# EAGLE board PCB_eLock_G592_J1 (EAGLE 6.2), part 1 of 2
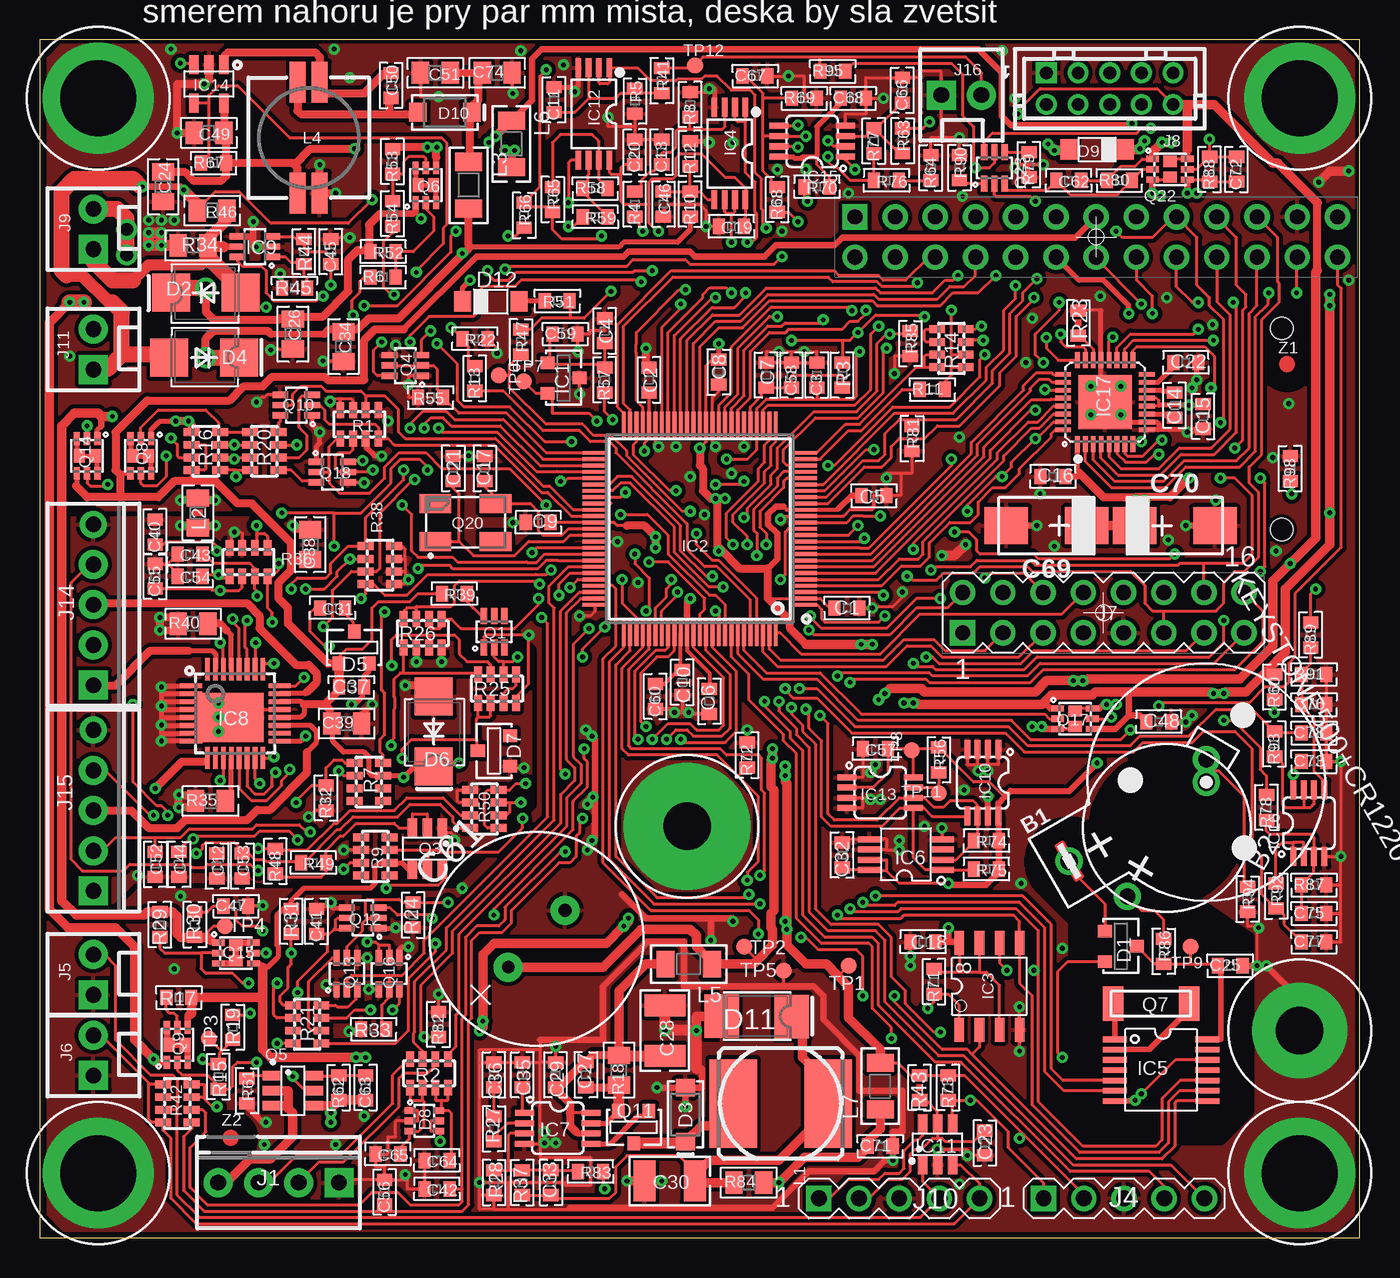
[diagram p3: board, top side]
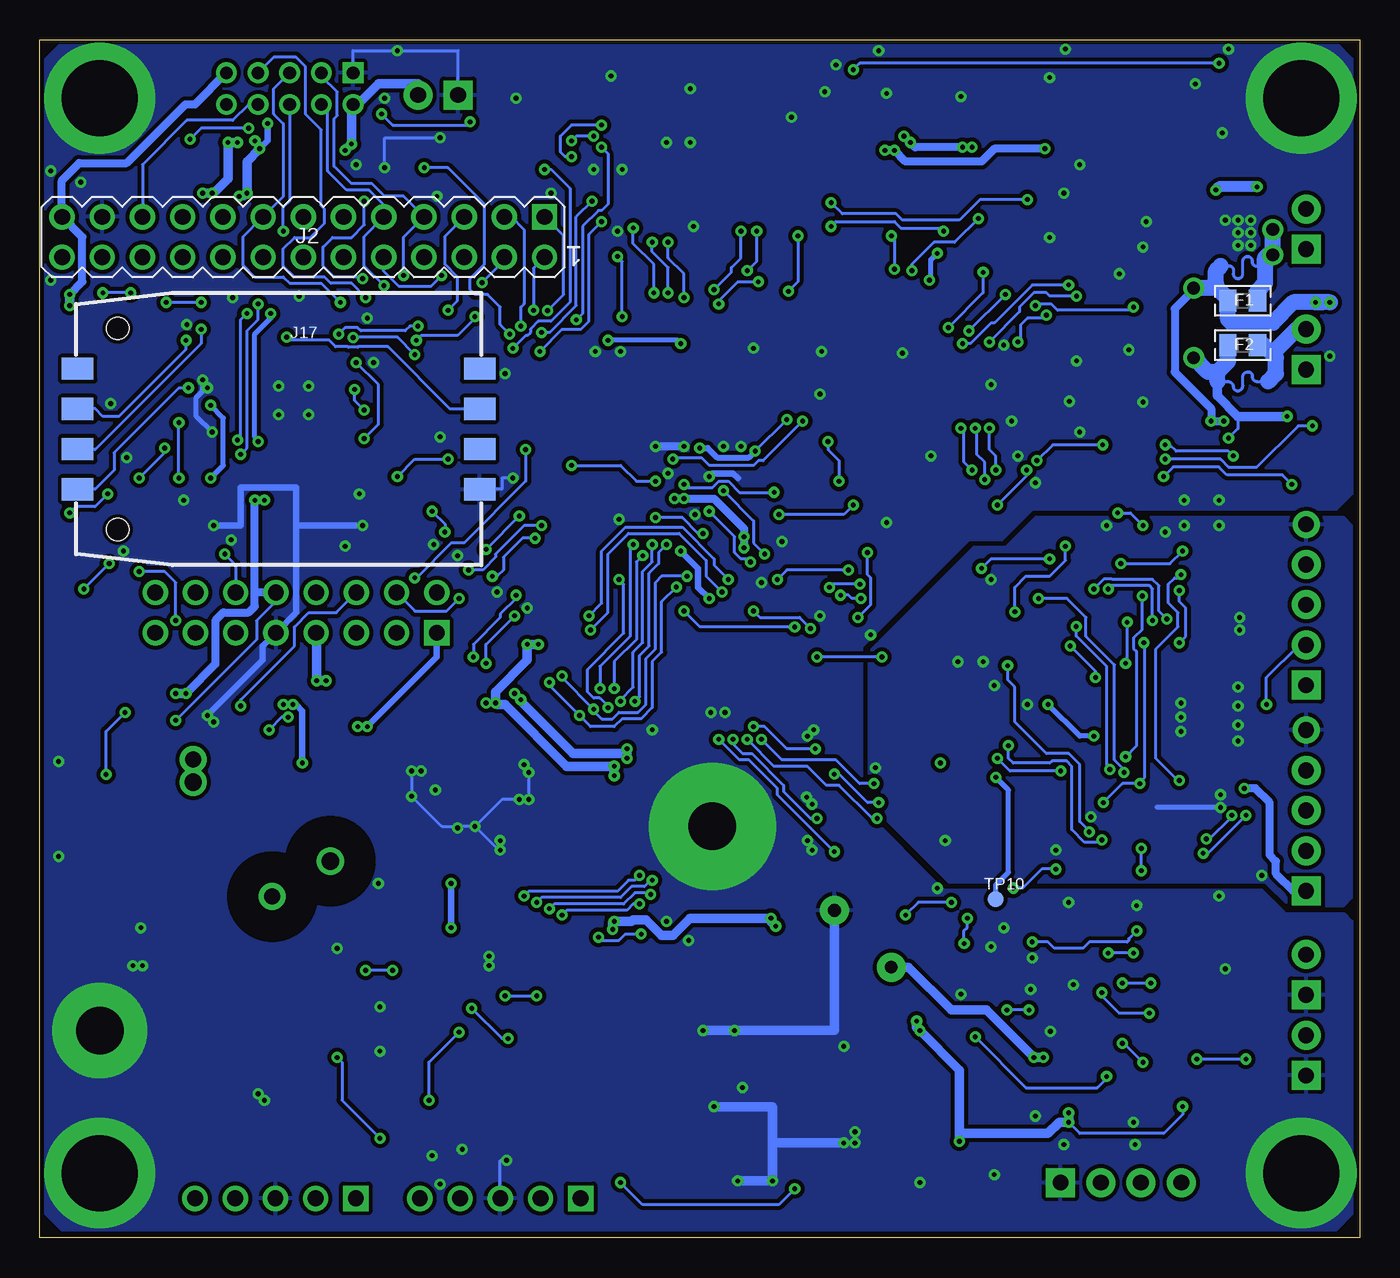
[diagram p4: board, bottom side, seen from below]

Size 83.4 x 75.7 mm. Coordinates in mm from the lower left corner, seen from the top.
Copper layers (1+16): Top 0.035mm / dielectric 1.5mm / Bottom 0.035mm
Design rules: minimum track width 0.2mm, minimum drill 0.3mm, track to track 0.153mm, track to pad 0.15mm, pad to pad 0.162mm, via to via 0.15mm, smd to smd 0.15mm, copper to edge 5mil, drill to drill 8mil, minimum pad ring 0.2mm, minimum via ring 0.2mm, stop-mask expansion 4mil, vias tented up to drill 0.3mm, thermal gap 10mil
tRestrict: area 69.6,51.2 to 70.4,51.3; area 10.4,34.6 to 14.2,35.1; 29 lines

## Footprints (pad centres in the part's own frame; a part is rotated, then mirrored left to right if it is on the bottom)
KEYSTONE500 = drill 1.1 pad 1.727: + 0,-10; - 0,0
EECRG0V224H = drill 1 pad 1.7: + 0,5; - 0,-5
0603 = smd 0.762 x 0.965: 1 -0.787,0; 2 0.787,0
0805 = smd 1.092 x 1.397: 1 -0.94,0; 2 0.94,0
1210 = smd 1.397 x 2.591: 1 -1.6,0; 2 1.6,0
CE5/13 = drill 0.8 pad 1.829: + -2.54,0; - 2.54,0
CT-C = smd 2.743 x 2.311: + -2.54,0; - 2.54,0
SOT-23 = smd 0.787 x 0.889: 1 0.991,1.016; 2 -0.94,1.016; 3 0.025,-1.016
SMB = smd 2.4 x 2.4: A 2.2,0; C -2.2,0
SOD-123 = smd 1.1 x 1.2: A 1.7,0; C -1.7,0
SOT-363 = smd 0.42 x 0.6: 1 -0.65,-0.95; 2 0,-0.95; 3 0.65,-0.95; 4 0.65,0.95; 5 0,0.95; 6 -0.65,0.95
SOD-123' = smd 1.092 x 1.295: A 1.781,-0.051; K -1.781,-0.051
SMA = smd 2.159 x 2.743: + -2.311,0.003; - 2.108,-0.002
SOD-123'' = smd 1.092 x 1.295: 1+ -1.781,-0.051; 2 1.781,-0.051
SQFP-S-12X12-100 = smd 0.24 x 1.6: 1 -4.8,-6.6; 2 -4.4,-6.6; 3 -4,-6.6; 4 -3.6,-6.6; 5 -3.2,-6.6; 6 -2.8,-6.6; 7 -2.4,-6.6; 8 -2,-6.6; 9 -1.6,-6.6; 10 -1.2,-6.6; 11 -0.8,-6.6; 12 -0.4,-6.6; 13 0,-6.6; 14 0.4,-6.6; 15 0.8,-6.6; 16 1.2,-6.6; 17 1.6,-6.6; 18 2,-6.6; 19 2.4,-6.6; 20 2.8,-6.6; 21 3.2,-6.6; 22 3.6,-6.6; 23 4,-6.6; 24 4.4,-6.6; 25 4.8,-6.6; 51 4.8,6.6; 52 4.4,6.6; 53 4,6.6; 54 3.6,6.6; 55 3.2,6.6; 56 2.8,6.6; 57 2.4,6.6; 58 2,6.6; 59 1.6,6.6; 60 1.2,6.6; 61 0.8,6.6; 62 0.4,6.6; 63 0,6.6; 64 -0.4,6.6; 65 -0.8,6.6; 66 -1.2,6.6; 67 -1.6,6.6; 68 -2,6.6; 69 -2.4,6.6; 70 -2.8,6.6; 71 -3.2,6.6; 72 -3.6,6.6; 73 -4,6.6; 74 -4.4,6.6; 75 -4.8,6.6 | smd 1.6 x 0.24: 26 6.6,-4.8; 27 6.6,-4.4; 28 6.6,-4; 29 6.6,-3.6; 30 6.6,-3.2; 31 6.6,-2.8; 32 6.6,-2.4; 33 6.6,-2; 34 6.6,-1.6; 35 6.6,-1.2; 36 6.6,-0.8; 37 6.6,-0.4; 38 6.6,0; 39 6.6,0.4; 40 6.6,0.8; 41 6.6,1.2; 42 6.6,1.6; 43 6.6,2; 44 6.6,2.4; 45 6.6,2.8; 46 6.6,3.2; 47 6.6,3.6; 48 6.6,4; 49 6.6,4.4; 50 6.6,4.8; 76 -6.6,4.8; 77 -6.6,4.4; 78 -6.6,4; 79 -6.6,3.6; 80 -6.6,3.2; 81 -6.6,2.8; 82 -6.6,2.4; 83 -6.6,2; 84 -6.6,1.6; 85 -6.6,1.2; 86 -6.6,0.8; 87 -6.6,0.4; 88 -6.6,0; 89 -6.6,-0.4; 90 -6.6,-0.8; 91 -6.6,-1.2; 92 -6.6,-1.6; 93 -6.6,-2; 94 -6.6,-2.4; 95 -6.6,-2.8; 96 -6.6,-3.2; 97 -6.6,-3.6; 98 -6.6,-4; 99 -6.6,-4.4; 100 -6.6,-4.8
SO-08 = smd 0.61 x 1.524: 1 -1.905,-2.743; 2 -0.635,-2.743; 3 0.635,-2.743; 4 1.905,-2.743; 5 1.905,2.743; 6 0.635,2.743; 7 -0.635,2.743; 8 -1.905,2.743
TSSOP8 = smd 0.35 x 1.2: 1 -0.975,-2.925; 2 -0.325,-2.925; 3 0.325,-2.925; 4 0.975,-2.925; 5 0.975,2.925; 6 0.325,2.925; 7 -0.325,2.925; 8 -0.975,2.925
TSSOP014 = smd 0.356 x 1.524: 1 -1.95,-2.873; 2 -1.305,-2.873; 3 -0.65,-2.873; 4 -0.005,-2.873; 5 0.65,-2.873; 6 1.295,-2.873; 7 1.95,-2.873; 8 1.95,2.962; 9 1.295,2.962; 10 0.65,2.962; 11 -0.005,2.962; 12 -0.65,2.962; 13 -1.305,2.962; 14 -1.95,2.962
TSSOP08-3 = smd 0.38 x 1.4: 1 -0.94,-2.343; 2 -0.305,-2.343; 3 0.33,-2.343; 4 0.965,-2.343; 5 0.965,2.292; 6 0.33,2.292; 7 -0.305,2.292; 8 -0.94,2.292
MSOP-08 = smd 0.38 x 1.2: 1 -1.008,-2.18; 2 -0.358,-2.18; 3 0.292,-2.18; 4 0.942,-2.18; 5 0.942,2.045; 6 0.292,2.045; 7 -0.358,2.045; 8 -1.008,2.045
SQFP-S-5X5-32 = smd 0.3 x 1.4: 1 -1.75,-2.8; 2 -1.25,-2.8; 3 -0.75,-2.8; 4 -0.25,-2.8; 5 0.25,-2.8; 6 0.75,-2.8; 7 1.25,-2.8; 8 1.75,-2.8; 17 1.75,2.8; 18 1.25,2.8; 19 0.75,2.8; 20 0.25,2.8; 21 -0.25,2.8; 22 -0.75,2.8; 23 -1.25,2.8; 24 -1.75,2.8 | smd 1.4 x 0.3: 9 2.8,-1.75; 10 2.8,-1.25; 11 2.8,-0.75; 12 2.8,-0.25; 13 2.8,0.25; 14 2.8,0.75; 15 2.8,1.25; 16 2.8,1.75; 25 -2.8,1.75; 26 -2.8,1.25; 27 -2.8,0.75; 28 -2.8,0.25; 29 -2.8,-0.25; 30 -2.8,-0.75; 31 -2.8,-1.25; 32 -2.8,-1.75 | smd 3.1 x 4.3: G 0.25,-0.35
SC70-6 = smd 0.4 x 1: 1 -0.635,-1.111; 2 0.015,-1.111; 3 0.665,-1.111; 4 0.665,1.089; 5 0.015,1.089; 6 -0.635,1.089
MSOP-08' = smd 0.38 x 1.2: 1 -1,-2.1; 2 -0.35,-2.1; 3 0.3,-2.1; 4 0.95,-2.1; 5 0.95,2.1; 6 0.3,2.1; 7 -0.35,2.1; 8 -1,2.1
SOT23-6 = smd 0.6 x 1.2: 1 -0.95,-1.3; 2 0,-1.3; 3 0.95,-1.3; 4 0.95,1.3; 5 0.003,1.3; 6 -0.95,1.3
SOT23-5 = smd 0.6 x 1.2: 1 -0.95,-1.206; 2 0,-1.206; 3 0.95,-1.206; 4 0.95,1.206; 5 -0.95,1.206
LFCSP_5X5_032 = smd 1 x 0.3: 1 -2.65,1.75; 2 -2.65,1.25; 3 -2.65,0.75; 4 -2.65,0.25; 5 -2.65,-0.25; 6 -2.65,-0.75; 7 -2.65,-1.25; 8 -2.65,-1.75; 17 2.65,-1.75; 18 2.65,-1.25; 19 2.65,-0.75; 20 2.65,-0.25; 21 2.65,0.25; 22 2.65,0.75; 23 2.65,1.25; 24 2.65,1.75 | smd 0.3 x 1: 9 -1.75,-2.65; 10 -1.25,-2.65; 11 -0.75,-2.65; 12 -0.25,-2.65; 13 0.25,-2.65; 14 0.75,-2.65; 15 1.25,-2.65; 16 1.75,-2.65; 25 1.75,2.65; 26 1.25,2.65; 27 0.75,2.65; 28 0.25,2.65; 29 -0.25,2.65; 30 -0.75,2.65; 31 -1.25,2.65; 32 -1.75,2.65 | smd 3.4 x 3.4: PAD 0,0
3-641215-4 = drill 1 pad 1.829 square: 1 3.81,0 | drill 1 pad 1.829: 2 1.27,0; 3 -1.27,0; 4 -3.81,0
MA13-2 = drill 1 pad 1.6 square: 1 -15.24,-1.27 | drill 1 pad 1.6: 2 -15.24,1.27; 3 -12.7,-1.27; 4 -12.7,1.27; 5 -10.16,-1.27; 6 -10.16,1.27; 7 -7.62,-1.27; 8 -7.62,1.27; 9 -5.08,-1.27; 10 -5.08,1.27; 11 -2.54,-1.27; 12 -2.54,1.27; 13 0,-1.27; 14 0,1.27; 15 2.54,-1.27; 16 2.54,1.27; 17 5.08,-1.27; 18 5.08,1.27; 19 7.62,-1.27; 20 7.62,1.27; 21 10.16,-1.27; 22 10.16,1.27; 23 12.7,-1.27; 24 12.7,1.27; 25 15.24,-1.27; 26 15.24,1.27
MA05-1 = drill 1 pad 1.6 square: 1 -5.08,0 | drill 1 pad 1.6: 2 -2.54,0; 3 0,0; 4 2.54,0; 5 5.08,0
3-641215-2 = drill 1 pad 1.829 square: 1 2.54,0 | drill 1 pad 1.829: 2 0,0
MA08-2 = drill 1 pad 1.6 square: 1 -8.89,-1.27 | drill 1 pad 1.6: 2 -8.89,1.27; 3 -6.35,-1.27; 4 -6.35,1.27; 5 -3.81,-1.27; 6 -3.81,1.27; 7 -1.27,-1.27; 8 -1.27,1.27; 9 1.27,-1.27; 10 1.27,1.27; 11 3.81,-1.27; 12 3.81,1.27; 13 6.35,-1.27; 14 6.35,1.27; 15 8.89,-1.27; 16 8.89,1.27
DF11-10DP-2DSA = drill 0.8 pad 1.321 square: 1 4,-1 | drill 0.8 pad 1.321: 2 4,1; 3 2,-1; 4 2,1; 5 0,-1; 6 0,1; 7 -2,-1; 8 -2,1; 9 -4,-1; 10 -4,1
3-641215-5 = drill 1 pad 1.829 square: 1 5.08,0 | drill 1 pad 1.829: 2 2.54,0; 3 0,0; 4 -2.54,0 | drill 1 pad 1.702: 5 -5.08,0
CCM03-3504LFT-NR = smd 2 x 1.4: C1 12.7,3.81; C2 12.7,1.27; C3 12.7,-1.27; C4 12.7,-3.81; C5 -12.7,3.81; C6 -12.7,1.27; C7 -12.7,-1.27; C8 -12.7,-3.81 | hole 1.4: 10.16,6.35; 10.16,-6.35
CR75 = smd 5.6 x 3: 1 0,-3; 2 0,3
0805-0RTOP = smd 1.092 x 1.397: 1 -0.94,0; 2 0.94,0
1206 = smd 1.143 x 1.702: 1 -1.473,0; 2 1.473,0
DRQ73 = smd 2.6 x 1: 1 -3.5,0.7; 2 -3.5,-0.7; 3 3.5,-0.7; 4 3.5,0.7
PCB-MB59 = drill 4.8 pad 7: 1 3.7,4.1; 2 79.6,4.1; 3 79.6,72; 4 3.7,72 | drill 3 pad 8: 5 40.9,26 | drill 3 pad 6: 6 79.6,13.1
SC70-6' = smd 0.4 x 1: 1 -0.635,-1.011; 2 0.015,-1.011; 3 0.665,-1.011; 4 0.665,0.989; 5 0.015,0.989; 6 -0.635,0.989
SSOT-6 = smd 0.6 x 1.2: 1 -0.95,-1.306; 2 0,-1.306; 3 0.95,-1.306; 4 0.95,1.306; 5 0.003,1.306; 6 -0.95,1.306
MICRO_FET = smd 0.4 x 0.8: 1 -0.65,-1.1; 2 0,-1.1; 3 0.65,-1.1; 4 0.65,1.1; 5 0,1.1; 6 -0.65,1.1 | smd 0.7 x 0.86: P1 -0.5,0; P2 0.5,0
CM519 = smd 1.3 x 2.2: 1 -2.4,0; 2 2.4,0
7B = smd 2 x 1.2: 1 -1.9,-1.2; 2 1.9,-1.2; 3 1.9,1.2; 4 -1.9,1.2
0603-ARRAY = smd 0.5 x 1: 1 -1.2,-0.9; 2 -0.4,-0.9; 3 0.4,-0.9; 4 1.2,-0.9; 5 1.2,0.9; 6 0.4,0.9; 7 -0.4,0.9; 8 -1.2,0.9
0603-0RTOP = smd 0.762 x 0.965: 1 -0.787,0; 2 0.787,0
SMD_ROUND_1MM = smd 1 x 1: P$1 0,0

## Placement (x,y rotation side)
B1  KEYSTONE500+CR1220  [KEYSTONE500]  73.7,28.8 300 top
B2  DNP-EECRG0V224H  [EECRG0V224H]  71.2,25.9 150 top
C1  1u/10V  [0603]  51,39.8 0 top
C2  0.1uF  [0603]  38.5,54.2 90 top
C3  0.1uF  [0603]  49.1,54.5 90 top
C4  10uF/4V  [0603]  35.7,57.3 90 top
C5  0.1uF  [0603]  52.7,46.9 0 top
C6  1u/10V  [0603]  42.3,33.9 270 top
C7  10uF/4V  [0603]  45.9,54.5 90 top
C8  1u/10V  [0603]  42.9,54.7 270 top
C9  10uF/4V  [0603]  31.5,45.2 180 top
C10  10uF/4V  [0603]  40.6,35.1 90 top
C11  10nF  [0603]  32.5,71.9 90 top
C12  10nF  [0603]  11.2,23.5 270 top
C13  10nF  [0603]  39.3,68.6 90 top
C14  1u/10V  [0603]  71.7,52.6 90 top
C15  4.7u/6.3V  [0603]  73.5,51.9 90 top
C16  0.1uF  [0603]  64,48.1 180 top
C17  18pF  [0603]  28.12,48.61 270 top
C18  0.1uF  [0603]  55.8,18.7 180 top
C19  0.1uF  [0603]  43.7,63.9 180 top
C20  0.1uF  [0603]  37.6,68.6 90 top
C21  18pF  [0603]  26.12,48.61 270 top
C22  4.7u/6.3V  [0603]  72.4,55.3 180 top
C23  0.1uF  [0603]  59.7,6 270 top
C24  4.7u/16V  [0805]  7.8,66.4 270 top
C25  10uF/4V  [0603]  75.2,17.2 0 top
C26  4.7u/16V  [0805]  16,57.1 270 top
C27  1nF  [0603]  34.5,10.3 270 top
C28  22u/16V  [1210]  39.5,13.1 90 top
C29  1u/16V  [0603]  32.6,10.3 90 top
C30  47u/6.3V  [1210]  39.8,3.6 180 top
C31  10nF  [0603]  18.5,39.8 180 top
C32  0.1uF  [0603]  50.7,24.2 90 top
C33  5pF  [0603]  32.3,3.5 270 top
C34  4.7u/16V  [0805]  19.2,56.3 270 top
C35  0.1uF  [0603]  30.5,10.3 90 top
C36  220pF  [0603]  28.7,10.3 90 top
C37  1u/16V  [0603]  19.7,34.8 0 top
C38  4.7u/16V  [0805]  17.1,43.8 90 top
C39  4.7u/16V  [0805]  19.4,32.5 0 top
C40  10nF  [0603]  7.3,44.6 90 top
C41  1nF  [0603]  17.5,20 90 top
C42  10nF  [0603]  25.1,3.1 180 top
C43  10nF  [0603]  9.5,43.2 180 top
C44  10nF  [0603]  8.8,23.6 270 top
C45  10nF  [0603]  18.4,62.3 90 top
C46  10nF  [0603]  39.4,65.3 270 top
C47  1nF  [0603]  12.4,20.97 0 top
C48  4.7u/6.3V  [0603]  70.7,32.6 180 top
C49  4.7u/16V  [0805]  10.7,69.8 180 top
C50  1u/16V  [0603]  22.2,72.8 270 top
C51  4.7u/16V  [0805]  25,73.6 180 top
C52  10nF  [0603]  7.3,23.6 270 top
C53  10nF  [0603]  12.8,23.5 270 top
C54  10nF  [0603]  9.5,41.8 180 top
C55  10nF  [0603]  7.3,41.8 90 top
C56  10nF  [0603]  21.8,2.9 90 top
C57  0.1uF  [0603]  52.8,30.9 180 top
C58  10uF/4V  [0603]  47.5,54.5 90 top
C59  10uF/4V  [0603]  33.2,57.1 0 top
C60  10uF/4V  [0603]  38.9,34.2 90 top
C61  1000u/16V  [CE5/13]  31.4,18.9 45 top
C62  1u/10V  [0603]  65,66.8 180 top
C63  10nF  [0603]  20.6,9.5 90 top
C64  1nF  [0603]  25.1,4.9 180 top
C65  1nF  [0603]  22,5.3 180 top
C66  10nF  [0603]  54.5,72.5 90 top
C67  0.1uF  [0603]  45.2,73.4 0 top
C68  10uF/4V  [0603]  51.4,72 0 top
C69  47u/T  [CT-C]  63.6,45 180 top
C70  47u/T  [CT-C]  71.7,45 0 top
C71  4.7u/6.3V  [0603]  53.1,5.8 0 top
C72  1u/10V  [0603]  75.6,67.5 90 top
C73  10uF/4V  [0603]  80.5,30.1 0 top
C74  4.7u/16V  [0805]  28.9,73.6 0 top
C75  10nF  [0603]  80.5,20.5 0 top
C76  10nF  [0603]  80.5,33.7 0 top
C77  0.1uF  [0603]  80.5,18.7 0 top
C78  0.1uF  [0603]  80.5,31.9 0 top
D1  BAS70-05E6327  [SOT-23]  68.3,18.4 90 top
D2  P6SMB16A  [SMB]  10.5,59.7 0 top
D3  STPS0540Z  [SOD-123]  40.8,7.8 90 top
D4  P6SMB16A  [SMB]  10.4,55.6 180 top
D5  BAT54S  [SOT-23]  19.9,37.3 180 top
D6  P6SMB16A  [SMB]  24.9,32 90 top
D7  BZX84C6V2  [SOT-23]  28.7,30.8 270 top
D8  BAT54BRW-7F  [SOT-363]  24.3,7.4 270 top
D9  RB060M  [SOD-123']  66.8,68.7 180 top
D10  STPS0540Z  [SOD-123]  25.6,71.1 180 top
D11  SMLVT3V3  [SMA]  45.2,14 180 top
D12  BZT52C1213-13-F  [SOD-123'']  28.5,59.2 0 top
F1  DNP-MFU0805FF03000P100  [0805]  7.4,59.2 0 bottom
F2  DNP-MFU0805FF03000P100  [0805]  7.4,56.4 0 bottom
IC1  ISL60002DIH325Z-TK  [SOT-23]  33.1,54.3 90 top
IC2  PIC24FJ1024GA610-I/PT  [SQFP-S-12X12-100]  41.7,44.8 90 top
IC3  N25Q032A13ESC  [SO-08]  60,15.9 0 top
IC4  MCP602-I/ST  [TSSOP8]  43.6,68.5 180 top
IC5  PCF2123TS/1-T  [TSSOP014]  70.8,10.6 270 top
IC6  LM75ADP  [TSSOP08-3]  54.7,24.2 90 top
IC7  LTC1771EMS8  [MSOP-08]  32.8,6.9 270 top
IC8  L6227Q  [SQFP-S-5X5-32]  12.36,33.13 270 top
IC9  INA214AIDCKT  [SC70-6]  13.6,62.6 90 top
IC10  24LC32A-I/MS  [MSOP-08']  59.55,28.75 180 top
IC11  PIC10F200T-I/OT  [SOT23-6]  56.72,5.92 0 top
IC12  MCP6022-I/ST  [TSSOP8]  35,71 180 top
IC13  24LC32A-I/MS  [MSOP-08']  53.1,28.1 270 top
IC14  SC4503TSKTRT  [SOT23-5]  10.7,72.9 180 top
IC15  MCP6542-I/MS  [MSOP-08']  48.8,69.3 90 top
IC16  MCP6042-I/MS  [MSOP-08']  80.2,26.2 0 top
IC17  LTC1955  [LFCSP_5X5_032]  67.3,52.8 90 top
J1  3-641215-4  [3-641215-4]  15.1,3.5 0 top
J2  PBC13DABN-2x13pinAu-5.8/2.5/5.8  [MA13-2]  66.74,63.23 180 bottom
J4  DNP  [MA05-1]  68.5,2.5 0 top
J5  3-641215-2  [3-641215-2]  3.4,17.9 270 top
J6  3-641215-2  [3-641215-2]  3.4,12.8 270 top
J7  8x2pin-Au-6/2,5/3  [MA08-2]  67.2,39.5 0 top
J8  DF11-10DP-2DSA(01)  [DF11-10DP-2DSA]  67.6,72.6 180 top
J9  3-641215-2  [3-641215-2]  3.4,65 270 top
J10  DNP  [MA05-1]  54.3,2.5 0 top
J11  3-641215-2  [3-641215-2]  3.4,57.4 270 top
J14  3-641215-5  [3-641215-5]  3.4,40 270 top
J15  3-641215-5  [3-641215-5]  3.4,27 270 top
J16  3-641215-2  [3-641215-2]  59.5,72.2 180 top
J17  DNP-CCM03-3504LFT-NR  [CCM03-3504LFT-NR]  68.3,51.1 180 bottom
L1  CR75-330KC  [CR75]  46.8,8.5 270 top
L2  DNP  [0805-0RTOP]  10,45.8 90 top
L3  EMI390R  [1206]  27.1,66.5 270 top
L4  DRQ73-3R3-R  [DRQ73]  17,69.5 90 top
L5  EMI390R  [1206]  41,17.3 180 top
L6  EMI390R  [1206]  29.8,69.1 270 top
L7  EMI390R  [1206]  53.1,9.6 90 top
PCB1  PCB-MB59  [PCB-MB59]  0,0 0 top
Q1  FDG6303N  [SC70-6']  28.7,38.3 0 top
Q3  FDC6330L  [SSOT-6]  24.5,24.6 180 top
Q4  FDG6303N  [SC70-6']  23.1,55.1 90 top
Q5  FDC6330L  [SSOT-6]  16,9.3 270 top
Q6  SSM6P49NU,LFPZ  [MICRO_FET]  24.4,66.5 0 top
Q7  CM519 32.768KDZF-UT  [CM519]  70.2,14.8 180 top
Q8  SSM6P49NU,LFPZ  [MICRO_FET]  6.4,49.4 180 top
Q9  SSM6P49NU,LFPZ  [MICRO_FET]  8.7,12.2 0 top
Q10  FDG6303N  [SC70-6']  16.2,52.6 90 top
Q11  FDN352AP  [SOT-23]  37.5,7 0 top
Q12  FDG6303N  [SC70-6']  20.4,20.2 90 top
Q13  FDG6303N  [SC70-6']  19.4,16.7 0 top
Q14  SSM6P49NU,LFPZ  [MICRO_FET]  3,49.4 180 top
Q15  SSM6P49NU,LFPZ  [MICRO_FET]  12.4,18 270 top
Q16  FDG6303N  [SC70-6']  22.1,16.7 180 top
Q17  SSM6P49NU,LFPZ  [MICRO_FET]  65.4,32.8 270 top
Q18  FDG6303N  [SC70-6']  18.5,48.4 270 top
Q20  7B-28.63636MAAJ-T  [7B]  26.9,45.2 0 top
Q22  SSM6P49NU,LFPZ  [MICRO_FET]  71.4,67.5 270 top
Q23  FDG6303N  [SC70-6']  60.3,67.6 0 top
R1  100K  [0603-ARRAY]  20.2,51.4 0 top
R2  470R  [0603-ARRAY]  24.6,10.4 0 top
R3  300R  [0603]  50.7,54.5 90 top
R4  4.99M  [0603]  37.6,65.3 90 top
R5  22K  [0603]  37.6,71.8 270 top
R6  1M  [0603]  21.7,60.7 0 top
R7  3.3K  [0603-ARRAY]  20.8,28.8 90 top
R8  1M  [0603]  41.1,71.6 90 top
R9  100K  [0603-ARRAY]  21.2,24.1 270 top
R10  4.99M  [0603]  41.1,65.3 90 top
R11  3.57K  [0603]  56.4,53.6 0 top
R12  1M  [0603]  41.1,68.5 90 top
R13  649R  [0603]  27.5,54.3 90 top
R14  220K  [0603-ARRAY]  57.6,56.2 90 top
R15  4.99M  [0603]  11.3,10.2 90 top
R16  470K  [0603-ARRAY]  10.5,49.7 270 top
R17  4.99M  [0603]  8.8,15.2 0 top
R18  0.12R  [0805]  36.6,10.6 90 top
R19  4.99M  [0603]  12.2,13.3 270 top
R20  220K  [0603-ARRAY]  14.2,49.7 270 top
R21  1M  [0603-ARRAY]  16.9,13.5 90 top
R22  1M  [0603]  27.5,56.8 180 top
R23  DNP  [0603-0RTOP]  65.6,57.8 270 top
R24  4.99M  [0603]  23.6,20.4 90 top
R25  33K  [0603-ARRAY]  28.9,34.7 0 top
R26  100K  [0603-ARRAY]  24.2,38.2 0 top
R27  10K  [0603]  28.7,6.9 270 top
R28  1M  [0603]  28.7,3.5 270 top
R29  4.99M  [0603]  7.6,19.8 90 top
R30  4.99M  [0603]  9.8,19.8 270 top
R31  4.99M  [0603]  15.9,20 90 top
R32  300R  [0603]  18.1,27.8 90 top
R33  4.99M  [0603]  21.1,13.2 0 top
R34  0.025R  [0805]  9.7,62.7 180 top
R35  0.12R  [0805]  10.8,27.6 0 top
R36  10K  [0603-ARRAY]  13.2,42.7 0 top
R37  DNP  [0603]  30.5,3.5 90 top
R38  1M  [0603-ARRAY]  21.5,42.5 90 top
R39  300R  [0603]  26.2,40.7 180 top
R40  0.12R  [0805]  9.7,38.8 0 top
R41  110K  [0603]  39.3,73.1 270 top
R42  100K  [0603-ARRAY]  8.7,8.5 270 top
R43  DNP  [0603-0RTOP]  55.6,9.5 90 top
R44  7.68K  [0603]  16.7,62.3 90 top
R45  100R  [0603]  16.1,60 0 top
R46  0.12R  [0805]  10.9,64.9 180 top
R47  15K  [0603]  30.4,56.6 270 top
R48  649R  [0603]  14.9,23.8 90 top
R49  649R  [0603]  17.3,23.7 180 top
R50  100K  [0603-ARRAY]  28.1,27.1 90 top
R51  649R  [0603]  32.7,59.2 0 top
R52  4.99M  [0603]  21.7,62.3 180 top
R53  4.99M  [0603]  22.3,68 90 top
R54  1M  [0603]  22.3,64.7 90 top
R55  1M  [0603]  24.7,53.1 0 top
R56  10K  [0603]  56.8,30.2 270 top
R57  300R  [0603]  35.7,54.2 90 top
R58  210K  [0603]  35.1,66.3 0 top
R59  3.57K  [0603]  35.1,64.5 180 top
R60  3.57K  [0603]  78,34.8 90 top
R61  300K  [0603]  13.1,9.3 270 top
R62  1M  [0603]  18.9,9.5 90 top
R63  4.99M  [0603]  54.5,69.3 270 top
R64  1M  [0603]  56.3,67.6 90 top
R65  3.57K  [0603]  32.4,65.6 270 top
R66  7.68K  [0603]  30.6,64.6 270 top
R67  DNP  [0603]  11,67.9 0 top
R68  1M  [0603]  46.6,65.6 90 top
R69  1M  [0603]  48.3,72 0 top
R70  3.57K  [0603]  49.1,66.4 180 top
R71  1M  [0603]  56.5,16.2 90 top
R72  1M  [0603]  44.7,30.5 90 top
R73  15K  [0603]  57.4,9.5 90 top
R74  10K  [0603]  59.8,25.1 180 top
R75  10K  [0603]  59.8,23.3 180 top
R76  240K  [0603]  53.5,66.8 180 top
R77  510K  [0603]  52.7,69.3 90 top
R78  4.99M  [0603]  77.5,27.2 90 top
R79  300K  [0603]  62.5,67.8 90 top
R80  300K  [0603]  68.2,66.8 0 top
R81  4.99M  [0603]  55.1,50.5 270 top
R82  4.99M  [0603]  25.2,13.5 90 top
R83  1.69M  [0603]  34.8,4.2 180 top
R84  1R  [0805]  44.8,3.5 0 top
R85  470K  [0603]  55,56.5 270 top
R86  3.57K  [0603]  71,18.1 270 top
R87  1M  [0603]  80.5,22.3 0 top
R88  300K  [0603]  73.9,67.5 90 top
R89  4.99M  [0603]  80.3,38.1 90 top
R90  300K  [0603]  58.1,67.6 270 top
R91  1M  [0603]  80.5,35.6 0 top
R92  3.57K  [0603]  78.1,21.6 270 top
R93  3.57K  [0603]  78,31.2 90 top
R94  3.57K  [0603]  76.3,21.4 270 top
R95  1M  [0603]  50.1,73.7 0 top
R98  300K  [0603]  79,48.6 90 top
TP1  DNP-TestPoint  [SMD_ROUND_1MM]  51.1,17.2 0 top
TP2  DNP-TestPoint  [SMD_ROUND_1MM]  44.5,18.4 0 top
TP3  DNP-TestPoint  [SMD_ROUND_1MM]  10.7,12.6 0 top
TP4  DNP-TestPoint  [SMD_ROUND_1MM]  11.7,19.7 0 top
TP5  DNP-TestPoint  [SMD_ROUND_1MM]  46.99,16.88 180 top
TP6  DNP-TestPoint  [SMD_ROUND_1MM]  29,54.5 270 top
TP7  DNP-TestPoint  [SMD_ROUND_1MM]  30.6,54.1 0 top
TP8  DNP-TestPoint  [SMD_ROUND_1MM]  55.1,30.8 90 top
TP9  DNP-TestPoint  [SMD_ROUND_1MM]  72.7,18.4 180 top
TP10  DNP-TestPoint  [SMD_ROUND_1MM]  23,21.4 0 bottom
TP11  DNP-TestPoint  [SMD_ROUND_1MM]  56.8,28.1 90 top
TP12  DNP-TestPoint  [SMD_ROUND_1MM]  41.4,74.05 0 top
Z1  DNP-FiducialMark  [REF]  78.8,55.2 0 top
Z2  DNP-FiducialMark  [REF]  12.06,6.32 0 top

## Tracks (layer width: path | path; a pad name or v marks a point on that pad's centre or on a via)
3.3V-CMP-FILTERED
  Top 0.2: 49.1,68.29 49.1,67.8 49.89,67.01 R70.1
  Top 0.3: C68.1 50.61,71.71 49.1,70.2 49.1,68.3 | 49.1,68.3 49.1,68.29 | 49.1,68.3 48.2,68.3 48.1,68.2 47.7,68.2 47.6,68.3 IC15.8
+3,3V  (via drill 0.3 pad 0.66, 0.3 pad 0.7)
  Top 0.2: v38.2,49.7 38.2,50.2 38.5,50.5 C2.1 IC2.46 | v41.7,49.9 42.1,50.3 IC2.37 42.1,55.1 42.49,55.49 C8.1 | v47.5,56.7 50.7,56.7 | 50.7,56.7 R3.2 | v36.2,51.7 35.7,52.2 R57.1 | IC17.13 70.55,53.05 70.7,52.9 70.7,52.6 70.65,52.55 IC17.12 | C1.1 49.9,39.8 49.3,40.4 IC2.2 46,40.4 | 37.1,45 36.5,45 36.3,45.2 IC2.62 C9.1 | 50.7,56.7 51.2,56.7 v51.7,57.2 52.8,58.3 55.8,58.3 v55.9,58.2 | v59.6,56.7 58.6,56.7 R14.3 | v11.2,8.3 10.9,8.3 10.4,8.8 10.4,8.9 | 10.4,8.9 R42.7 | R42.8 10.4,9.7 10.4,8.9 | D8.5 24.7,7.4 24.7,6.75 D8.4 25.3,6.75 v25.3,6.1 | J4.2 65.96,2.74 62.15,6.55 | 62.15,6.55 58.41,10.29 R73.2 R43.2 55.01,10.29 54.23,11.07 L7.2 | v64.6,11.4 64.3,11.7 64.3,16.8 64.96,17.46 D1.2 | v61.9,6.3 62.15,6.55 | 47.2,20 v47.1,20 | TP1.P$1 50.5,16.6 50.4,16.6 | R60.2 77.81,35.59 77.55,35.85 | 69.2,44.86 69.16,44.9 C70.+ | v48.5,65.5 48.31,65.69 R70.2 | v74.8,32.7 75.4,32.7 77.1,31 77.1,29.6 77.5,29.2 R78.2 | R98.1 79,47.6 79.1,47.5 v79.1,47
  Top 0.24: 50.5,46.1 50.4,46 IC2.16 47.2,46 47,46.2 | 42.71,55.49 C8.1 | C6.1 42.3,35.7 40.9,37.1 IC2.86 40.9,39.3
  Top 0.3: C8.1 42.81,55.49 42.8,55.5 42.9,55.6 v42.9,56.5 | C15.2 73.49,52.69 73.4,52.6 v72.6,52.6 70.7,52.6 | IC17.1 65.55,48.45 65.61,48.39
  Top 0.4: 50.5,46.1 51.3,46.9 C5.1 | 47,46.2 46.5,46.2 46.02,45.72 46.02,45.08 46.6,44.5 46.6,42.9 46,42.3 | 40.9,39.3 40.9,40.2 v41.1,40.4 | Q17.1 63.85,33.45 63.5,33.8 63.55,33.85 63.55,33.95 | Q17.4 67.95,32.15 68.8,33 | 68.8,33 68.8,34.5 | 68.8,33 69.51,33 C48.2 | C16.1 65.5,48.1 65.7,48.3
  Top 0.5: 65.61,48.39 65.7,48.3 67.2,46.8 69.2,46.8 | 69.2,46.8 71.4,46.8 v72.6,48 72.7,48 | 69.2,46.8 v69.2,46.6 v69.8,46.6 | 48.4,37.5 47.4,38.5 47.4,39 46,40.4 46,42.3 44.2,42.3 42.9,43.6 | 37.1,45 38.2,45 v38.9,44.3 v38.9,43.6 | v41.7,49.9 41.7,48.8 41.9,48.6 41.9,47.2 42.4,46.7 v42.7,46.7 42.8,46.7 | v43.3,46.7 42.8,46.7 | 42.8,46.7 42.8,43.7 42.9,43.6 | v42.9,43.4 42.9,43.6
  Top 0.6: v52.6,37.5 v51.9,37.5 48.4,37.5 | v81.5,59.6 v81.5,58.9 v81.5,45.8 81.5,43.8 78.7,41 78.7,37 77.55,35.85 76.2,34.5 74.9,34.5 v74.8,34.4 v74.15,34.4 74.1,34.4 74,34.5 68.8,34.5 66.7,34.5 66.5,34.3 63.9,34.3 63.55,33.95 63.3,33.7 55.5,33.7 55.4,33.8 v55.2,33.8 v54.6,33.8 | L7.2 53.1,11.9 51.1,13.9 51.1,15.9 50.4,16.6 49.7,17.3 48.4,17.3 47.2,18.5 47.2,20 47.2,28.7 47.1,28.8 v47.1,29.2 v47.1,29.8 | v37.2,20.2 37.2,20 v36.9,19.7 35.8,18.6 28.7,18.6 28,17.9 28,13.3 v27.8,13.1 | C69.+ C70.+ | v69.2,46.6 69.2,44.86 | Q5.4 18.4,8.35 | 18.4,8.35 18.54,8.35 R62.1 C63.1 | v18.4,7.3 18.4,8.35
  Bottom 0.2: v38.2,49.7 v36.2,51.7 | v55.9,58.2 55.9,58.1 57,57 59.3,57 v59.6,56.7 | v51.7,57.2 51.2,57.2 49.5,58.9 49.5,64.5 v48.5,65.5 | v64.6,11.4 64.3,11.1 64.3,8.7 v61.9,6.3 | v11.2,8.3 11.2,7.8 12.4,6.6 17.7,6.6 v18.4,7.3 | 25.3,6.6 v25.3,6.1 | v74.8,32.7 69.7,37.8 69.7,39 68.47,40.23 J7.10 | v79.1,47 79.9,46.2 81.1,46.2 v81.5,45.8
  Bottom 0.3: v47.5,56.7 43.1,56.7 v42.9,56.5 | v72.6,52.6 71.8,51.8 71.8,48.8 v72.6,48
  Bottom 0.38: v38.2,49.7 38.6,49.3 40.6,49.3 41.2,49.9 v41.7,49.9
  Bottom 0.4: v42.9,56.5 42.8,56.5 | v42.9,43.4 41.8,42.3 41.8,41.1 v41.1,40.4
  Bottom 0.5: v81.5,59.6 80.7,60.4 80.7,63.22 J2.25 82,64.5 82,66.8 80.9,67.9 77.9,67.9 74.2,71.6 73.6,71.6 J8.9 | 74.1,34.4 v74.15,34.4 72.3,36.25 72.3,39 71.79,39.51 70.19,39.51 69.8,39.9 69.8,40.77 | v38.9,43.6 v38.9,44.3 38.9,44.8 40.8,46.7 v42.7,46.7 v43.3,46.7 | v69.2,46.6 v69.8,46.6 69.8,40.77 | J7.10 69.8,40.77
  Bottom 0.6: v81.5,58.9 v81.5,59.6 | v51.9,37.5 v52.6,37.5 52.6,36.5 54.6,34.5 v54.6,33.8 54.5,33.7 54,33.7 50.1,29.8 v47.1,29.8 v47.1,29.2 | v74.15,34.4 v74.8,34.4 | 25.3,6.6 19.7,6.6 19,7.3 v18.4,7.3 v18.4,7.9 | v25.3,6.1 25.3,10.6 v27.8,13.1 28,13.3 v28,13.7 | v36.9,19.7 37.2,20 v37.2,20.2 42.3,20.2 43.4,19.1 44.1,19.1 45.1,20.1 45.9,20.1 46,20 v47.1,20 47.2,19.9 v47.2,19.5
+3.3V/1  (via drill 0.3 pad 0.7)
  Top 0.2: 65.6,33.3 65.75,33.45 Q17.6 | IC6.7 53.5,23.89 53.5,23.2 | 53.5,23.2 52.41,23.2 IC6.8 50.85,23.26 C32.1 | v57.4,22.4 54.3,22.4 53.5,23.2 | 60.56,25.13 R74.1 60.55,25.14 | 55,30.9 56.71,30.9 R56.1 58.99,28.8 60,28.8 60.95,27.85 | 55,30.9 C57.1 53.59,29.39 52.65,28.45 IC13.2 | IC3.8 58.09,16.79 | IC3.7 59.37,16.79 | 59.37,16.79 58.09,16.79 | 59.37,16.79 59.81,16.79 60.63,15.96 IC3.3 | 57.4,18.7 57.5,18.7 | IC13.8 55.2,30.8 TP8.P$1 55,30.8 55,30.9 | 58.09,16.79 56.7,16.79 R71.2
  Top 0.3: Q17.P1 65.6,33.3
  Top 0.38: 65.04,28.24 61.34,28.24 60.95,27.85 60.55,27.45 IC10.8 60.55,25.14
  Top 0.4: R74.1 R75.1 60.59,23.1 59.79,22.3 57.4,22.3 v57.4,22.4 | Q17.6 66.95,33.45 67.2,33.7 v67.4,33.7 v68,33.7 | C18.1 57.5,18.7 58.09,18.7 IC3.8 | v57.4,19.6 57.4,18.7 | 65.04,28.24 v66.8,30
  Bottom 0.4: v67.4,33.7 67.2,33.7 66.8,33.3 v66.8,30 | v57.4,22.4 v57.4,19.6
+3.3V/2  (via drill 0.3 pad 0.7)
  Top 0.2: Q17.3 65.25,32.15
  Top 0.3: 65.25,32.15 Q17.P2
  Top 0.4: Q17.3 63.45,32.15 v63.3,32.3 v62.7,32.3
  Bottom 0.4: v63.3,32.3 v62.7,32.3 58.31,36.69 J7.1
-VA  (via drill 0.3 pad 0.7)
  Top 0.2: v20.5,58.9 22.6,58.9 26,62.3 26,63.3 v26.3,63.6 | v14.3,58.8 13.6,58.8 D2.A | v33.4,63.9 33.71,63.9 R59.2
  Top 0.4: IC9.5 11.62,62.62
  Top 0.5: 10.6,63.1 10.6,62.74 R34.1
  Top 0.6: R34.1 10.7,62.64 10.7,62.6
  Top 0.7: 5.9,60.5 6.88,61.48 10.18,61.48 10.64,61.94 R34.1 10.72,62.62 11.62,62.62 | 12.6,59.7 D2.A | 3.4,61.7 J9.1 | 10.6,63.1 11.84,64.34 R46.1
  Top 1: R34.1 10.64,61.96 12.6,60 12.6,59.7 | 3.4,61.7 4.6,60.5 5.9,60.5
  Bottom 0.2: v14.3,58.8 14.5,58.6 19.1,58.6 19.5,59 20.4,59 v20.5,58.9 | v33.4,63.9 33.1,64.2 29.4,64.2 29,63.8 26.5,63.8 v26.3,63.6
-VB  (via drill 0.3 pad 0.7)
  Top 0.2: 9.96,65.34 10.34,65.34 11.1,66.1 12.6,66.1 14.6,64.1 19.5,64.1 v21,65.6 | IC12.5 33.58,68.08 33.4,67.9 v33.4,65.4
  Top 0.4: v6.5,66.4 8.9,66.4 v9.1,66.2
  Top 0.7: v9.1,66.2 9.96,65.34 R46.2 | v6.5,66.4 6.4,66.4 6.3,66.5
  Top 0.8: 4.6,59.1 4.4,59.1 2.7,60.8 1.7,60.8
  Top 1: J11.1 3.86,54.86 3.9,54.9 4.3,54.9 5.2,55.8 | 5.2,55.8 5.2,58.5 4.6,59.1 | 1.7,60.8 1.4,61.1 1.4,66.1 2.2,66.9 5.9,66.9 6.3,66.5 | D4.A 7.7,55.6 7.5,55.8 5.2,55.8
  Bottom 0.2: v33.4,65.4 32.7,64.7 29.3,64.7 28.9,64.3 25.3,64.3 24,65.6 v21,65.6
  Bottom 0.7: v6.5,66.4 8.9,66.4 v9.1,66.2
/3.3V1_ON
  Top 0.2: IC2.95 44.5,37.1 45.9,35.7 49.3,35.7 51.9,33.1 63.5,33.1 63.8,32.8 Q17.2
/CELL_3VON  (via drill 0.3 pad 0.7)
  Top 0.2: IC2.94 44.1,36.9 45.7,35.3 49.1,35.3 51.7,32.7 61.4,32.7 62.6,31.5 68.3,31.5 v68.9,32.1 | Q17.5 67.6,32.8 v67.7,32.9
  Bottom 0.2: v67.7,32.9 68.1,32.9 v68.9,32.1
/CHRG_SD
  Top 0.2: IC2.96 44.9,40.3 42.8,42.4 42,42.4 40.9,43.5 40.9,45.1 36.4,49.6 36.4,49.9 36,50.3 34.8,50.3 34.1,51 31.8,51 29.3,53.5 R13.1
/CL_CS1  (via drill 0.3 pad 0.7)
  Top 0.2: J2.19 74.36,64.44 75.6,63.2 75.6,60.2 76.2,59.6 76.2,58.8 76,58.6 76,50.4 v75.5,49.9 | IC2.1 49.1,40 49.4,39.7 49.4,39.1 49.6,38.9 53,38.9 v53.4,39.3 | v55.2,36.3 55.4,36.1 56.4,36.1 56.6,35.9 62.2,35.9 63,36.7 73.9,36.7 74.8,37.6 v74.8,39 | v77.1,48 77.4,47.7 77.4,42.4 v77.1,42.1
  Bottom 0.2: v77.1,48 75.5,49.6 v75.5,49.9 | v55.2,36.3 55.2,37.5 v53.4,39.3 | v74.8,39 74.8,41.4 75.5,42.1 v77.1,42.1
/CL_CS2  (via drill 0.3 pad 0.7)
  Top 0.2: IC2.17 49.8,46.4 52.1,48.7 53.2,48.7 53.8,49.3 53.8,50 54.3,50.5 55.9,50.5 56.7,51.3 58.1,51.3 60.65,53.85 60.65,54.65 61.7,55.7 61.7,58.2 62.8,59.3 v62.8,59.4
  Bottom 0.2: v62.8,59.4 63.7,60.3 65,60.3 65.4,60.7 67.3,60.7 68,61.4 68,62.5 67.3,63.2 66.3,63.2 65.4,64.1 65.4,65 65.6,65.2 65.6,70 66.6,71 66.6,74 67.2,74.6 68.6,74.6 J8.7
/FMEM1_CS  (via drill 0.3 pad 0.7)
  Top 0.2: IC2.93 43.7,36.7 44.8,35.6 44.8,34 47,31.8 47,31.4 47.8,30.6 47.8,20.2 49.4,18.6 52.4,18.6 52.6,18.4 52.6,14.5 53.8,13.3 v53.8,12.6 | IC3.1 58.09,14.71 57.39,15.41 R71.1 56.5,14.9 v56.1,14.5
  Bottom 0.2: v56.1,14.5 54.2,12.6 v53.8,12.6
/MCLR  (via drill 0.3 pad 0.7)
  Top 0.2: IC2.13 47.3,44.8 47.1,44.6 47.1,41.9 v46.8,41.6 | IC11.4 57.67,8.44 R73.1 57.41,8.7 v58.8,8.7 59.2,8.7 61.2,6.7 61.2,5.7 63.42,3.48 J4.1 | v56.9,13 56.5,13 54.7,14.8 54.7,15.6 53.8,16.5 53.8,19 53,19.8 50,19.8 49,20.8 49,31.2 48.2,32 48.2,32.4 47.5,33.1 v47.5,33.5
  Bottom 0.2: v46.8,41.6 46.5,41.3 46.5,38.2 48.8,35.9 48.8,34.5 48.4,34.1 48,34.1 47.5,33.6 v47.5,33.5 | v58.8,8.7 58.8,11.1 v56.9,13
/MCLR2
  Top 0.2: J10.1 49.9,2.5 51.1,3.7 53,3.7 53.4,4.1 54.3,4.1 54.6,4.4 54.6,5.5 55.3,6.2 55.5,6.2 55.77,6.47 IC11.6
/SM_FAULT(MH_STROBE)  (via drill 0.3 pad 0.7)
  Top 0.2: v59.7,55.8 59.4,55.5 59.4,54.4 57.5,52.5 53.9,52.5 50.2,48.8 v49.8,48.8 | IC17.24 64.35,55.45 63.6,56.2 v63.6,56.88 | v44.5,47.8 44.3,47.6 v42.7,47.6 | IC2.58 36.7,46.8 v37,47.1
  Bottom 0.2: v63.6,56.88 63.58,56.9 60.8,56.9 v59.7,55.8 | v49.8,48.8 46.7,48.8 45.7,47.8 v44.5,47.8 | v42.7,47.6 42.5,47.4 40.9,47.4 40.5,47.8 39.9,47.8 39.2,47.1 v37,47.1
A_3VOFF  (via drill 0.3 pad 0.7)
  Top 0.2: Q13.5 19.41,18.41 | 19.41,18.41 19.4,18.4 | 19.41,18.41 20.4,19.4 20.4,19.9 20.7,20.2 | 20.7,20.2 21.4,20.2 Q12.2 20.71,20.21 20.7,20.2 | 20.7,20.2 20.6,20.3 20.6,21.3 20.7,21.4 22.7,21.4 22.9,21.2 23.59,21.2 R24.2 25.79,21.19 v25.8,21.2 | IC2.84 40.1,37.1 39.7,36.7 39,36.7 38,35.7 38,32.6 v38.3,32.3 | v34.4,30.9 34.4,30.3 34.6,30.1 34.6,28.5 33.7,27.6 33.7,25.8 28.7,20.8 v28.7,20.4
  Bottom 0.2: v25.8,21.2 27.9,21.2 v28.7,20.4 | v34.4,30.9 36.2,30.9 37.6,32.3 v38.3,32.3
A_ACT_ON
  Top 0.2: IC2.61 33.6,45.6 32.1,47.1 31.7,47.1 28.7,50.1 22.4,50.1 22,50.5 R1.4 21.4,51.2 21.2,51.4 18.3,51.4 18,51.7 18,52.3 17.7,52.6 17.23,52.6 Q10.2
ACT-L-SENSE  (via drill 0.3 pad 0.7)
  Top 0.2: R26.8 23,39.6 23.2,39.8 23.7,39.8 | 23.7,39.8 23.8,39.9 26,39.9 26.2,40.1 26.2,41.2 26.5,41.5 31.38,41.5 v31.58,41.3 | R26.7 23.8,39.7 23.7,39.8 | IC2.71 34,41.6 v33.5,41.1
  Bottom 0.2: v33.5,41.1 33.3,41.3 v31.58,41.3
ACT-L-SW  (via drill 0.3 pad 0.7)
  Top 0.2: v5.9,33.7 5.9,28.8 7.4,27.3 7.7,27.3 8.1,26.9 v8.1,26.7 | R25.8 27.6,35.7 23,35.7 | 23,35.7 R26.1 | 23,35.7 22.8,35.7 22.4,35.3 22.4,34.15 22.45,34.1 22.45,33.45 22.4,33.4 22.4,31.6 22.2,31.4 v22.2,31.1 | v16.3,25.15 15.75,25.7 13.9,25.7 13.6,25.4 9.9,25.4 v9.7,25.2 9.5,25.2 8.8,24.5 C44.1
  Bottom 0.2: J14.2 3.84,37.46 5.9,35.4 v5.9,33.7 | v9.7,25.2 9.5,25.2 8.1,26.6 v8.1,26.7 | v22.2,31.1 22.2,30.3 21.9,30 19.6,30 19.5,30.1 19.48,30.1 19.46,30.12 18.52,30.12 18.2,29.8 18.2,25.8 17.4,25 16.45,25 v16.3,25.15
ACT-R-SENSE  (via drill 0.3 pad 0.7)
  Top 0.2: R26.6 24.6,38.6 24.7,38.5 25.3,38.5 25.4,38.6 R26.5 26,39.1 26.6,38.5 30,38.5 31.52,40.02 v31.52,40.4 | IC2.70 33.5,42 32.8,41.3 v32.8,40.6
  Bottom 0.2: v32.8,40.6 32.3,40.6 32.1,40.4 v31.52,40.4
ACT-R-SW  (via drill 0.3 pad 0.7)
  Top 0.2: J15.2 3.96,24.46 4.8,25.3 7.3,25.3 | 24.6,38.1 26.2,38.1 26.5,37.8 26.5,36.9 27,36.4 28.3,36.4 28.5,36.2 R25.7 | 24.6,38.1 R26.3 | 24.6,38.1 22.55,38.1 22.25,37.8 v22.25,36.15 | 7.3,25.3 8.9,25.3 9.45,25.85 13.45,25.85 13.7,26.1 16.4,26.1 16.8,25.7 17.05,25.7 v17.1,25.65 | C52.1 7.3,25.3
  Bottom 0.2: v22.25,36.15 22.25,35.25 21.8,34.8 21.8,32.6 19.8,30.6 18.4,30.6 17.7,29.9 17.7,26.3 17.1,25.7 v17.1,25.65
ACT_EN  (via drill 0.3 pad 0.7)
  Top 0.2: IC2.54 33.24,48.4 33.22,48.42 32.66,48.42 32.64,48.4 31.4,48.4 28.9,50.9 25.45,50.9 v25.2,51.15 | v24.5,48.5 24.5,48.7 24,49.2 22.8,49.2 22.2,48.6 22.2,47.7 20.3,45.8 18.6,45.8 | 18.6,45.8 v15.3,45.8 | 13.7,44.4 13.7,43.7 R36.6 | v13.7,45 13.7,44.4 | R36.5 14.4,44.3 14.2,44.5 13.8,44.5 13.7,44.4 | v21.8,39.55 21.6,39.35 21.6,34.6 21.8,34.4 21.8,31.8 21.5,31.5 21.5,30.7 21.7,30.5 R7.4 | v18.6,43.7 18.6,45.8
  Bottom 0.2: v24.5,48.5 25,49 25,50.95 v25.2,51.15 | v15.3,45.8 14.5,45.8 v13.7,45 | v21.8,39.55 21.8,41.1 21.1,41.8 19.6,41.8 18.6,42.8 v18.6,43.7
ACT_L1  (via drill 0.3 pad 0.7)
  Top 0.2: IC2.52 31.8,49.2 29.3,51.7 26.2,51.7 25.7,52.2 24.2,52.2 23.4,51.4 v23.4,51.15 | v23,48.5 23,47.9 20.6,45.5 R38.5 19.5,43.7 18.4,42.6 18.4,42 18.1,41.7 16.3,41.7 15.9,41.3 v15.9,41 | IC8.27 13.11,37.19 13,37.3 13,38.9 v13.1,39
  Bottom 0.2: v23.4,51.15 23.4,49.8 23,49.4 v23,48.5 | v13.1,39 13.1,41 13.3,41.2 15.7,41.2 v15.9,41
ACT_L2  (via drill 0.3 pad 0.7)
  Top 0.2: IC8.28 12.61,36.79 12.6,36.8 12.6,38.5 12.2,38.9 v12.2,39.1 | v16.8,41 18,41 18.8,41.8 18.8,42.1 v19.6,42.9 R38.6 | IC2.68 32.72,42.8 32.7,42.82 32.02,42.82 31.5,42.3 26.1,42.3 25.9,42.5 24.1,42.5 v23.9,42.3
  Bottom 0.2: v12.2,39.1 12.7,39.6 12.7,41.2 13.1,41.6 15.64,41.6 15.66,41.62 16.18,41.62 v16.8,41 | v19.6,42.9 23.3,42.9 v23.9,42.3
ACT_L+
  Top 0.3: IC8.31 11.11,36.89 10.9,37.1 9.4,37.1
  Top 0.5: 9.4,37.1 7,37.1 4.8,34.9 3.42,34.9 J14.1
ACT_L-
  Top 0.3: IC8.23 16.78,34.38 16.9,34.5
  Top 0.5: 16.9,34.5 17.5,35.1 17.5,35.7 17,36.2 16.2,36.2 13.9,38.5 13.9,39.3 13.1,40.1 3.5,40.1 J14.3
ACT_R1  (via drill 0.3 pad 0.7)
  Top 0.2: IC2.53 31.6,48.8 29.1,51.3 26,51.3 25.5,51.8 24.7,51.8 24.3,51.4 v24.3,51.15 | v23.7,47.9 23.6,47.9 21.5,45.8 21.5,42.3 21.3,42.1 R38.7 19.7,42.1 18.5,40.9 18.5,39.2 v17.92,38.62 | IC8.13 12.61,28.39 13.35,27.65 14.35,27.65 15.3,28.6 15.3,28.9 15.8,29.4 v15.8,29.6
  Bottom 0.2: v23.7,47.9 23.7,49 24.2,49.5 24.2,51.05 v24.3,51.15 | v15.8,29.6 16,29.8 16,36.1 17.92,38.02 v17.92,38.62
ACT_R2  (via drill 0.3 pad 0.7)
  Top 0.2: IC8.14 13.11,28.54 13.6,28.05 14.2,28.05 14.7,28.55 14.7,29.2 v14.9,29.4 | v20.3,40.4 20.6,40.7 R38.8 21.1,41.3 21.8,40.6 23.2,40.6 24.5,41.9 31.34,41.9 31.36,41.92 32.02,41.92 v32.3,42.2 | IC2.78 37.7,39.2 36.8,40.1 v36.8,41.6
  Bottom 0.2: v14.9,29.4 14.9,29.6 15.5,30.2 15.5,36.2 17.3,38 17.3,39.2 18.5,40.4 v20.3,40.4 | v32.3,42.2 36.2,42.2 v36.8,41.6
ACT_R+  (via drill 0.3 pad 0.7)
  Top 0.3: 10.5,30.1 10.61,30.1 IC8.9
  Top 0.5: 10.5,30.1 9,30.1 v7.3,28.4
  Bottom 0.5: v7.3,28.4 6.6,28.4 5.7,27.5 5.7,24.2 5.3,23.8 5.3,23 4.22,21.92 J15.1
ACT_R-
  Top 0.3: IC8.19 17.12,32.38 17.5,32 17.5,31.3 16.9,30.7
  Top 0.5: 16.9,30.7 16.9,29.4 14.55,27.05 13.75,27.05 13.1,26.4 9.2,26.4 8.7,25.9 6.9,25.9 5.8,27 J15.3
AVDD
  Top 0.2: IC2.30 44.9,52.5 45.6,53.2 45.6,53.6 45.9,53.6 C7.1 C58.1 47.5,54.5 50.7,54.5 R3.1
B_3VOFF  (via drill 0.3 pad 0.7)
  Top 0.2: IC2.66 31.4,43.6 v31.1,43.3 | v31.7,39.2 32.1,38.8 32.1,26.6 24.3,18.8 24.3,18 22.9,16.6 22.1,16.6 | Q13.2 19.41,16.32 19.7,16.6 22.1,16.6 | 22.1,16.6 22.1,15.73 Q16.5 22.09,15.19 21.6,14.7 21.6,13.49 R33.2
  Bottom 0.2: v31.1,43.3 31.1,41.9 30.9,41.7 30.9,40 v31.7,39.2
B_ACT_ON
  Top 0.2: IC2.60 33.7,46 32.2,47.5 31.8,47.5 28.8,50.5 23.1,50.5 22.65,50.95 22.65,52.35 21.8,53.2 20.6,53.2 | Q10.5 15.91,52.62 16,52.7 16,53.3 16.5,53.8 17.8,53.8 18.1,53.5 20.3,53.5 20.6,53.2 | 20.6,53.2 R1.6
BATA  (via drill 0.3 pad 0.7, 0.8 pad 1.32)
  Top 0.2: v38.1,63.6 37.9,63.8 37.9,64.21 R4.1 | v38.7,61.1 37.6,61.1 37.5,61 30.1,61 29.6,60.5 28.7,60.5 28.3,60.9 v28.3,61.1 | 23.71,64.79 v24.1,64.4 | v10.3,11.3 10.6,11 R15.2 11.39,11 11.39,11.69 11.5,11.8 | R19.2 11.55,11.85 11.5,11.8 | TP3.P$1 11.5,11.8
  Top 0.3: Q8.1 7.05,51.05 7.6,51.6 v8.6,51.6
  Top 0.4: C26.1 16.07,58.04 16.13,58.1 16.23,58.2 | Q9.1 7.4,11.1 | 21.5,64.7 23.6,64.7 23.7,64.8 | Q6.1 23.75,64.85 23.7,64.8 | 23.71,64.79 23.7,64.8
  Top 0.5: 10.4,60 10.5,59.9 10.5,58.5 11,58 15.1,58 15.2,58.1 16.13,58.1 | 16.23,58.2 17.9,58.2 19.5,59.8 19.5,61.8 20.1,62.4 20.81,62.4 R52.2 20.8,62.41 20.8,64 21.5,64.7 | R16.1 9.6,51.4 v9.4,51.6 v8.6,51.6 | R15.2
  Top 0.6: v1.9,59.1 0.6,57.8 0.6,20.8 1.8,19.6 4.8,19.6 6,18.4 6,12.5 v7.2,11.3 7.4,11.1
  Top 1: J9.2 4.9,65 5.5,64.4 v5.5,63.7 v5.5,62.1 | v10.5,60 10.4,60 9,60 8.7,59.7 D2.C | v1.9,59.1 v2.8,59.1
  Bottom 0.2: 8.8,61.4 8.3,61.4 arc90 8,61.2 8,60.9 arc-90 7.7,60.6 arc-90 7.4,60.9 7.4,61.7 arc90 7.1,62 arc90 6.8,61.7 arc-90 6.6,61.4 6,61.4 | v38.7,61.1 38.1,61.7 v38.1,63.6 | v24.1,64.4 25.6,62.9 26.9,62.9 28.3,61.5 v28.3,61.1 | v7.2,11.3 v10.3,11.3
  Bottom 0.5: v8.6,51.6 v9.4,51.6 9.4,52.4 11.7,54.7 11.7,58.7 10.5,59.9 v10.5,60
  Bottom 1: 8.8,61.4 9.1,61.1 9.1,60.3 9.2,60.2 | v10.5,60 9.4,60 9.2,60.2 | v5.5,63.7 v5.5,62.1 5.8,62.1 6,61.9 6,61.4 6,60.3 6.46,59.84 F1.2 | v2.8,59.1 4.2,59.1 5.5,57.8 8.1,57.8 8.34,58.04 F1.1 8.34,59.34 9.2,60.2 | v2.8,59.1 2.4,59.1 | v1.9,59.1 v2.8,59.1
BATA_D_OFF  (via drill 0.3 pad 0.7)
  Top 0.2: Q18.2 18.18,48.38 18.2,48.4 18.3,48.4 | R1.1 18.8,50.5 18.3,50 18.3,48.4 | v32,46.3 29.7,48.6 25.4,48.6 24.4,49.6 22.7,49.6 21.8,48.7 21.8,48 20.85,47.05 18.95,47.05 18.3,47.7 18.3,48.4 | v36.7,45.7 38.4,45.7 39.7,44.4 39.7,43.2 42.3,40.6 42.7,40.6 43.3,40 IC2.92
  Bottom 0.2: v32,46.3 32.6,45.7 v36.7,45.7
BATB  (via drill 0.3 pad 0.7, 0.8 pad 1.32)
  Top 0.2: R16.3 8.8,49.3 8.7,49.4 8.7,50.12 v8.3,50.52 | 10.6,19 10.6,19.3 11,19.7 TP4.P$1
  Top 0.3: R10.1 41.1,63.7 40.3,62.9 36.9,62.9 36.6,62.6 27.2,62.6 27.1,62.7 | Q15.1 10.95,18.65 10.8,18.8 | Q14.1 3.65,51.05 3.9,51.3 | D12.1+ 26.72,60.02 v27.2,60.5
  Top 0.4: 14.6,57.1 18,57.1 | 19.17,57.4 19.2,57.4 | 19.2,57.4 19.7,57.4 | 19.2,57.4 C34.1 | 3.9,51.3 3.9,51.9
  Top 0.5: 14.6,57.1 14.4,57.3 11,57.3 10.5,56.8 v10.5,55.6 | 18,57.1 18.3,57.4 19.17,57.4 | 19.7,57.4 20.1,57.4 20.8,58.1 22.7,58.1 26.7,62.1 v26.7,62.2 26.8,62.2 27.1,62.5 27.1,62.7 L3.2 | 9.79,19 R30.2 9.9,19.01 9.91,19 | 4.7,51.9 v4.6,51.9 | 7.89,20.6 7.61,20.6 R29.2
  Top 0.6: 7.89,20.6 6.8,20.6 6.6,20.4 2.3,20.4 1.4,21.3 1.4,51.3 2.2,52.1 3.7,52.1 3.9,51.9 v4.6,51.9 | R29.2 8.41,20.59 8.7,20.3 8.7,19.2 8.9,19 9.79,19 | 10.8,18.8 10.6,19 9.91,19
  Top 1: v10.5,55.6 D4.C
  Bottom 0.2: 5.8,54.1 6.5,54.1 arc90 6.8,54.4 6.8,54.5 arc-90 7.1,54.7 arc-90 7.4,54.4 7.4,53.9 arc90 7.7,53.5 arc90 8,53.8 arc-90 8.4,54.1 9,54.1 | 7.7,51.9 7.7,51.12 v8.3,50.52
  Bottom 0.3: v10.5,55.6 10.3,55.4 | v27.2,60.5 27.1,60.5 27.1,61.8 v26.7,62.2
  Bottom 0.6: 9,54.1 9,53.2 7.7,51.9 v4.6,51.9
  Bottom 1: 5.8,54.1 5.3,54.6 5.3,55.6 5.55,55.85 | 9,54.1 9,54.6 | 9,54.6 9.1,54.7 9.6,54.7 v10.5,55.6 | F2.1 8.34,55.36 9,54.7 9,54.6 | F2.2 6.1,56.4 5.55,55.85 | J11.2 4,57.4 5.55,55.85
BATB_D_OFF  (via drill 0.3 pad 0.7)
  Top 0.2: R1.2 19.8,49.8 19.6,49.6 18.9,49.6 18.7,49.4 18.7,48.6 18.91,48.38 Q18.5 20.93,48.38 v21.05,48.5 | v22.9,46.3 23.5,45.7 23.5,43.4 23.9,43 26.1,43 26.4,42.7 30.78,42.7 30.8,42.68 31.38,42.68 31.9,43.2 IC2.67
  Bottom 0.2: v21.05,48.5 21.05,48.15 v22.9,46.3
BTN_1
  Top 0.2: J5.2 4.1,17.9 4.8,17.2 4.8,12.5 7,10.3 8.4,10.3 8.7,10 8.7,8.9 | 8.7,8.1 8.7,2.7 10.1,1.3 55.64,1.3 J10.4 55.77,3.57 IC11.1 | 8.7,8.1 R42.3 | R42.2 8.7,8.9 | 8.7,8.9 8.7,8.1
BTN_1PIN  (via drill 0.3 pad 0.7)
  Top 0.2: IC2.90 42.5,37.3 44,35.8 44,32 43.3,31.3 40.7,31.3 v40.5,31.5 | R42.6 10.3,8.1 10.5,7.9 10.5,6.7 9.5,5.7 9.5,3.2 10.6,2.1 20.2,2.1 21,2.9 22.6,2.9 23.4,2.1 26.5,2.1 26.7,2.3 26.7,3.1 | 26.7,3.1 26.7,13.9 26.9,14.1 26.9,19 27.6,19.7 29,19.7 29.4,20.1 29.4,20.9 32.9,24.4 v33.2,24.4 | C42.1 26.7,3.1
  Bottom 0.2: v33.2,24.4 36.8,28 36.8,28.4 38.6,30.2 39.2,30.2 v40.5,31.5
BTN_2
  Top 0.2: J6.2 3.9,12.8 6.9,9.8 6.9,9.7 | 6.9,9.7 6.9,7.5 7.1,7.3 R42.4 7.8,6.8 8.3,6.3 8.3,2.5 9.9,0.9 57.78,0.9 J10.5 59.38,3.42 58.18,4.62 IC11.3 | R42.1 6.9,9.7
BTN_2PIN  (via drill 0.3 pad 0.7)
  Top 0.2: IC2.89 42.1,37.1 43.6,35.6 43.6,32.2 43.1,31.7 41.3,31.7 40.9,32.1 40.2,32.1 v39.6,31.5 | 21.8,1.7 10.4,1.7 9.1,3 9.1,6.4 9.6,6.9 R42.5 | 21.8,1.7 26.7,1.7 27.1,2.1 27.1,13.7 27.3,13.9 27.3,18.8 27.8,19.3 29.2,19.3 29.8,19.9 29.8,20.7 32.8,23.7 33.5,23.7 33.9,24.1 33.9,25.4 34.1,25.6 34.1,26.3 v34.3,26.5 | C56.1 21.8,1.7
  Bottom 0.2: v39.6,31.5 39.6,31.2 39,30.6 38.4,30.6 36.4,28.6 36.4,28.2 34.7,26.5 v34.3,26.5
CBA
  Top 0.2: Q4.5 Q4.2 24.89,55.12 25.1,54.9 25.1,53.6 25.2,53.5 25.2,53.39 R55.2 26.49,52.1 29.5,52.1 32,49.6 IC2.51
CHRG-IN  (via drill 0.3 pad 0.7)
  Top 0.2: Q22.3 71.25,66.85
  Top 0.4: 71.25,66.85 Q22.P2 | Q6.4 25.05,68.25 | L6.1 31.1,71.87 31.1,74.5 31.7,75.1 59.3,75.1 60.8,73.6 60.8,70.86 61.36,70.3 69,70.3 v69,70.4 | v70.3,66 Q22.3
  Top 0.5: R53.2 22.41,68.9 v24.5,68.9 v25.1,68.9 25.05,68.9 25.05,68.25 | L6.1 29.77,70.57 v28.8,69.6 v28.4,69.2 | v69.5,68.8 69.6,68.8 69.6,69.1 v69.8,69.3 | v70.3,66 70.5,65.8 v70.8,65.8
  Top 0.6: D9.K 69.45,68.75 v69.5,68.8
  Bottom 0.4: v69,70.4 69,69.3 v69.5,68.8
  Bottom 0.5: v25.1,68.9 28.1,68.9 v28.4,69.2 v28.8,69.6 | v69.5,68.8 69.5,69 v69.8,69.3 | v70.8,65.8 70.5,65.8 v70.3,66
  Bottom 0.6: v70.3,66 70.3,68 v69.5,68.8
CL_IRQ  (via drill 0.3 pad 0.7)
  Top 0.2: IC2.20 49.5,47.6 54,52.1 57.7,52.1 59.8,54.2 59.8,55 60.9,56.1 60.9,58.6 61.65,59.35 v61.65,60.15
  Bottom 0.2: v61.65,60.15 62.9,61.4 62.9,63.26 J2.9 61.66,65.26 62.6,66.2 64,66.2 65.2,67.4 65.2,71.2 J8.4
CMP-HI-LEVEL  (via drill 0.3 pad 0.7)
  Top 0.2: v49.8,68.3 49.8,68 50.2,67.6 50.41,67.6 51.21,66.8 R76.2 52.71,68.5 R77.1 | IC15.5 47.85,70.25 v47.9,70.3
  Bottom 0.2: v47.9,70.3 49.8,70.3 50.5,69.6 50.5,68.6 50.2,68.3 v49.8,68.3
CMP-LO-LEVEL
  Top 0.2: R77.2 52.88,70.09 C66.1 | R77.2 52.21,69.6 50.99,69.6 IC15.3 | R63.2 54.27,68.51 R77.2
CVREF0  (via drill 0.3 pad 0.7)
  Top 0.2: IC2.88 41.7,39.4 42,39.7 42,40.4 39.7,42.7 v38.5,42.7 | v41.1,45.9 40.6,45.9 37.1,49.4 37.1,49.7 36.1,50.7 35,50.7 34.3,51.4 32,51.4 29.7,53.7 29.7,54.5 | 29.7,54.5 29.7,55.1 R47.2 | TP6.P$1 29.7,54.5
  Bottom 0.2: v38.5,42.7 38.7,42.9 39.1,42.9 39.5,43.3 39.5,44.3 v41.1,45.9
CVREF1  (via drill 0.3 pad 0.7)
  Top 0.2: IC2.34 43.3,52.5 44.1,53.3 44.1,56.2 46.1,58.2 v46.6,58.2 | v29.4,61.2 29.6,61.4 37.1,61.4 37.5,61.8 40.8,61.8 41.1,61.5 46.4,61.5 v46.9,62 | v29.6,63.3 30.09,63.3 R66.2
  Bottom 0.2: v29.6,63.3 29.4,63.1 v29.4,61.2 | v46.6,58.2 46.6,61.7 v46.9,62
DGND  (via drill 0.3 pad 0.7)
  Top 0.2: C8.2 42.9,53.5 42.5,53.1 IC2.36 42.5,50.2 v42.7,50 | 70.7,51.1 70.65,51.05 | IC17.PAD 67.3,53.1 | IC2.45 38.9,50.2 v39.1,50 | v44.5,50 IC2.31 | IC2.65 v36.5,44 | IC2.75 35.1,39.6 34.8,39.3 v34.1,39.3 | C19.2 v42.1,63.9 42.1,64.9 41.7,65.3 39.8,65.3 39.4,64.9 C46.2 | v46.8,45.4 47,45.6 IC2.15 50.8,45.6 51.2,46 52.6,46 52.7,46.1 52.7,46.9 C5.2 54.4,46.9 54.4,48.3 | R1.3 20.6,50 | 21.2,49.4 v21.6,49.4 | R1.5 21.4,52.2 v22,51.6 | R1.7 19.8,52.9 19.7,53 19,53 | v18.35,52.85 18.5,53 19,53 | 19,53 R1.8 | Q18.4 20.46,47.73 v20.5,47.7 | Q1.1 28.07,37.97 28.2,38.1 v30.9,38.1 30.9,35 30.1,34.2 R25.4 | Q16.4 21.41,15.71 21.4,15.7 v20.8,15.7 | Q13.4 v20.69,17.69 v20.7,17.7 | Q13.1 18.77,15.94 18.7,16 v18.1,16 | C21.1 v27.1,49.4 C17.1 | C1.2 v52.6,39.8 52.7,39.9 53.9,39.9 54.5,40.5 v54.5,40.8 | v17.9,55.4 19.2,55.4 C34.2 | C26.2 14.66,56.16 v14.6,56.1 | C41.2 17.5,20.82 17.46,20.86 | Q10.4 14.37,53.27 14.2,53.1 14,53.1 v13.7,52.8 | 47.5,56 v46.7,56 45.9,56 C7.2 | 47.5,56 C58.2 C3.2 49.1,56 v48.3,56 47.5,56 | 35.69,58.09 C4.2 35.7,57.3 34.75,57.3 34.75,57.1 C59.2 34,57.09 v34,56 | v34.1,53.3 34.1,54.31 IC1.3 | D8.1 23.9,8.05 23.9,7.4 D8.2 22.5,7.4 22.5,6.4 22,6.4 22,5.29 21.21,5.29 | 31.6,11.09 C35.2 C36.2 27.8,11.1 | 31.6,5.96 31.6,11.09 | IC7.4 31.6,5.96 | 28.7,1.8 R28.2 27.8,2.71 | 27.8,2.71 v27.8,3.5 | v27.8,3.5 27.8,11.1 | 31.6,11.09 C29.2 v32.6,12.1 | 28.7,1.8 29.6,1.8 | 29.6,1.8 33.4,1.8 33.5,1.9 | 28.7,1.8 27.8,1.8 27.8,2.71 | 27.8,11.1 27.8,11.9 31.6,11.9 | 31.6,11.9 31.6,11.1 | 56.96,69.5 J16.1 56.96,73.7 55.6,73.7 55.6,73.29 C66.2 52.2,73.3 52.19,73.31 C68.2 | R64.2 56.3,69.5 56.96,69.5 | C68.2 52.19,71 50.9,71 IC15.4
  Top 0.2: 67.05,58.6 65.61,58.6 R23.1 | R81.2 55.1,48.3 54.4,48.3 | 31.6,5.96 31.6,5.1 34.8,5.1 34.8,3.3 33.2,3.3 33.2,3.5 29.6,3.5 | 29.6,3.5 v27.8,3.5 | 29.6,3.5 29.6,1.8 | R45.1 15.31,60.79 v15.2,60.9 | v19.6,63.2 18.51,63.2 C45.2 | R5.2 37.6,70.2 | 37.6,70.2 C20.2 | C20.2 | C20.2 38.4,69.4 38.4,69.39 C13.2 | R8.2 42.3,72.39 v42.3,72.6 | 37.6,70.2 35.9,70.2 v35.9,70.8 | C74.2 29.84,72.3 v29.9,72.3 | C51.2 24.06,72.1 v25.2,72.1 | v61.6,67.6 61.6,67.8 62.5,67.8 | C67.2 v47.3,73.4 48.3,73.4 48.3,72 R69.2 | C68.2 v53.3,72 | R85.2 54,55.71 v54,54.6 | 59.9,29.9 60.55,29.9 IC10.1 | 59.9,29.9 IC10.2 59.9,30.9 | 59.25,29.9 58.6,29.9 IC10.4 | 59.25,29.9 59.9,29.9 | 53.5,24.5 53.5,25.2 52.41,25.2 IC6.5 50.88,25.16 C32.2 | 53.5,24.5 52.41,24.5 IC6.6 | 54.4,48.3 53.5,48.3 v53.5,48 | 31.6,12.5 31.6,11.9 | v69.6,9.1 71.75,11.25 IC5.12 | PCB1.6 79.6,15.1 | 52,27.8 52,27.15 IC13.4 | 52,27.8 IC13.3 50.92,27.8 | C57.2 52.01,29.4 | 52.01,29.4 52.01,29.1 IC13.1 | 53.5,24.5 v54.3,24.5 | IC6.4 57.04,25.8 57,25.8 v57,25.9 | 59.9,29.9 v59.9,29.5 | 52,27.8 52.5,27.8 v52.5,27.7 | v52.5,29.4 52.01,29.4 | R72.2 v44.7,32.1 | R91.2 C76.2 C78.2 C73.2 v82.2,30.1 v82.2,24.1 | R87.2 82.2,22.3 | 82.2,22.3 v82.2,24.1 | C75.2 82.2,20.5 | 82.2,20.5 82.2,22.3 | C77.2 82.2,18.7 82.2,20.5 | R94.2 76.29,20.61 76.29,19.71 76.3,19.7 76.9,19.7 v76.9,17.2 | C56.2 19.1,3.69 J1.1 | C56.2 23.2,3.69 23.2,3.1 C42.2 C64.2 | C56.2 21.8,4.5 21.21,4.5 21.21,5.29 | C65.2 21.21,5.29 | R82.2 v25.2,15.4 | 58.6,5.21 58.6,5.6 v56.7,5.6 56.7,4.64 IC11.2 | C23.2 58.6,5.21 | v61.9,14.6 v61.91,14.6 IC3.4 v61.91,11.8 v61.9,11.8 | 58.6,5.21 v58.6,5.2 | C18.2 55.01,17.8 v55,17.8 v55,17.2 | Q4.1 23.3,54.47 v23.3,53.9 23.3,53.1 R55.1
  Top 0.2: R22.1 28.9,56.2 v28.9,55.9 | TP5.P$1 46.99,15.9 47.3,15.9 | IC10.3 59.25,29.9 | 20.35,13.05 20.35,13.16 R33.1 | v63.4,67.8 62.5,67.8 | R79.1 62.5,67.8 | R90.1 v58.1,69.5 56.96,69.5 | IC16.4 v82.2,24.1 | v22.5,56.4 22.5,55.77 Q4.4 | C47.2 13.22,21 v14.1,21
  Top 0.203: C58.2 C7.2
  Top 0.24: C10.1 40.6,33.2 | 40.6,33.2 v40.1,33.2 40.1,33.41 C60.1 | 40.6,33.2 v41,33.2 41,33.11 C6.2
  Top 0.3: IC17.PAD 68.3,52.8 v68.3,52 68.75,51.55 IC17.10 70.55,51.55 70.7,51.4 70.7,51.1 72.3,51.1 v72.5,50.9 72.8,50.9 73.01,51.11 C15.1 | 70.65,51.05 IC17.9 | C22.1 73.19,55.19 73.1,55.1 v73.1,54.2 | IC4.4 42.62,72.6 v42.3,72.6 | 67.3,53.1 67.05,53.35 IC17.21 67.05,58.6 | v29.9,45.2 C9.2 | 20.6,50 21.2,49.4 | Q10.1 17.21,51.39 v17.7,50.9 17.7,50.2 17.49,49.99 Q18.1 | 17.46,20.86 17.6,21 18.4,21 | 18.4,21 v18.4,21.2 | Q12.4 18.54,20.86 18.4,21 | Q12.1 22.46,19.57 v22.5,19.6 22.51,19.61 R24.1 | Q16.1 22.73,17.96 22.7,18 22.7,18.2 22.9,18.4 v23.3,18.4 | R12.2 42.21,69.29 v42.3,69.2 | IC12.4 34.02,72.72 33.99,72.69 C11.2
  Top 0.35: IC5.7 69.15,8.65 v69.2,8.7 v69.6,9.1
  Top 0.38: IC10.7 v59.9,27.9 v59.91,27.9
  Top 0.4: 33.5,1.9 46.3,1.9 48.6,4.2 52.7,4.2 53.4,4.9 v53.9,4.9 C71.2 | D3.A 41.84,9.5 41.84,10.7 41.5,10.7 | D3.A v39,9.5 | v40.8,8.3 D3.A | IC9.4 13.5,63.27 | 13.5,63.27 v13.5,64.2 | IC9.2 13.5,62.62 13.5,63.27 | 31.6,12.5 35.6,12.5 35.6,15.9 38.4,18.7 40.7,18.7 40.7,15.9 47.3,15.9 48.9,15.9 49.5,15.3 49.5,13.8 51.8,11.5 51.8,9.3 54.5,9.3 54.5,6.7 53.9,6.7 C71.2 | C25.2 v76.9,17.2 v77.5,17.2 79.6,15.1 | C48.1 v72.4,32.6 v72.8,33 | R61.2 13.1,8.3 14.1,7.3 v14.3,7.3 | C71.2 | v34.5,32.1 v34.9,31.7 35.1,31.5 35.1,27.85 | 35.1,27.85 35.1,25.3 v34.9,25.1 34.6,24.8 v34.6,24.5 | v34.6,27.4 34.6,27.5 v34.95,27.85 35.1,27.85 | v63,45 C69.- | v72.4,45 C70.- | 42.4,20.2 v42.4,18.8 | 42.4,20.2 38.3,20.2 36.8,21.7 | 42.4,20.2 43.8,20.2 v43.8,20
  Top 0.5: v17.7,67.8 L4.2 17.9,66 17.9,65.9 18,66 v18.7,66 | C49.2 v8.7,69.8 8.7,72.9 v10.4,72.9 10.7,73.2 IC14.2 | C2.2 38.3,55.2 v38.3,56.2 | R23.1 65.41,58.59 65.4,58.6 | v19.55,13.05 20.35,13.05 | 10.36,46.64 10.34,46.64 10.3,46.6 v11.1,46.6 10.1,46.6 | 10.1,46.6 v8.9,46.6 | L2.2 10.1,46.74 10.1,46.6
  Top 0.6: v37.1,3.6 v39.3,3.6 | D11.- 41.5,14 v41.5,13.1 | v57,43.1 57.8,43.1 v58.5,43.8 | v80.8,66.7 81.5,67.4 v82.7,67.4
  Top 0.7: v7.7,62.7 R34.2 | v7.7,62.7 v6.9,62.7 v6.9,63.5 v7.7,63.5 v7.7,62.7 | 41.5,10.7 v41.5,13.1 v39.5,13.1 C28.2
  Bottom 0.2: v53.5,48 54.2,48 54.2,47.3 J17.C5 | v61.6,67.6 61.6,69.5 v58.1,69.5 | J8.1 63.6,75 56.96,75 J16.1 | v54.3,24.5 54.4,24.5 v55.9,26 | v52.5,29.4 v52.5,27.7 54.2,27.7 v55.9,26 | v59.9,29.5 v59.9,27.9 58,26 57,26 | v55.9,26 57,26 | J10.3 54.3,4.9 v53.9,4.9 | 57,26 v57,25.9 | v72.8,53.7 73.1,53.7
  Bottom 0.3: v73.1,54.2 73.1,53.7 73.1,53.5 73.5,53.1 73.5,51.9 v72.5,50.9
  Bottom 0.4: v41.1,48.1 40.9,48.3 39.6,48.3 39.3,48 | v72.8,33 69.3,36.5 69.3,37.4 J7.9 67.2,39.5 67.2,45 | 67.2,45 v63,45 | 67.2,45 67.2,47.4 70.7,47.4 70.7,45 v72.4,45
  Bottom 0.5: v42.7,50 v44.5,50
  Bottom 0.6: v39.3,3.6 v37.1,3.6 37.1,6 | v41.5,13.1 v39.5,13.1 33.2,13.1 33.2,20.2 C61.- | 37.1,6 v32.6,6 | v40.8,8.3 37.1,8.3 37.1,6
  other vias: 13.7,62.6 33.1,74.1 68.3,53.8 1.9,55.7 8.5,17 26.7,22.1 78.1,43.4 66.4,53.8 66.4,52 6.9,64.3 7.7,64.3 8.5,64.3 31.9,6 31.9,6.7 74.1,57.7 58.1,50.6 62.3,55.3 67,59.5 62.7,58.1 71.2,59.4 46.9,63.6 51.1,66 48.4,67.5 40.2,50 77.9,49.3 46.6,67.5 58.3,65.8 33.8,72.4 43.8,69.2 30.4,75 18.6,75.1 19.6,73.3 60.8,75 42,45.7 43.7,48.3 62,22.4 64.6,18.3 59.3,29.5 58.4,28.3 53.1,27.7 52.8,29.9 54.3,25.1 14.2,5.9 23.1,4 18.7,5.9 20.5,7.7 37.8,41.4 58.1,3.4 63.2,47 74.3,46.6 77,19.6 71.3,44.1 64.1,43.7 78.9,52.7 8.3,75.1 61.6,72 8.9,21.6 82.7,60.5
  pour Bottom (isolate 0.254): 0.5,1.5 1.5,0.5 82,0.5 83,1.5 83,74.5 82,75.5 1.5,75.5 0.5,74.5 0.5,47 1.5,46 20.7,46 22.6,44.1 24.7,44.1 31.5,37.3 31.5,27.2 26.3,22 6.2,22 4.7,20.5 1,20.5 0.5,20
  pour Top (isolate 0.254): 0.5,1.5 1.5,0.5 82,0.5 83,1.5 83,74.5 82,75.5 1.5,75.5 0.5,74.5 0.5,47 1.5,46 20.7,46 23.2,43.5 25.3,43.5 31.5,37.3 31.5,27.2 26.3,22 6.2,22 4.7,20.5 1,20.5 0.5,20
DIN_SM  (via drill 0.3 pad 0.7)
  Top 0.2: IC17.27 63.55,53.55 v63.5,53.6 | v62.9,52.3 62.6,52.3 60.05,49.75 60.05,49.25 52.8,42 IC2.6
  Bottom 0.2: v63.5,53.6 63.5,52.9 v62.9,52.3
DOOR_L  (via drill 0.3 pad 0.7)
  Top 0.2: R50.2 29.5,26.7 29.7,26.9 29.7,27.5 | R50.3 29.7,27.5 | 29.7,27.5 v30.4,27.5 | v33.2,29.3 32.9,29.6 32.9,39.6 34.1,40.8 IC2.73
  Bottom 0.2: v30.4,27.5 31.1,27.5 32.9,29.3 v33.2,29.3
DOOR_L_SW  (via drill 0.3 pad 0.7)
  Top 0.2: J14.4 3.14,42.54 2,41.4 2,23.9 2.7,23.2 5.3,23.2 5.7,23.6 9.4,23.6 9.6,23.4 10.4,23.4 10.6,23.6 11.2,23.6 | R50.7 26.6,26.7 25.5,27.8 23.2,27.8 22.4,27 19.6,27 18.8,26.2 18.6,26.2 16.9,24.5 14.99,24.5 R48.2 14.89,24.6 v13.8,24.6 | 11.2,23.6 13.3,23.6 13.7,23.2 v13.8,23.2 | C12.1 11.2,23.6
  Bottom 0.2: v13.8,23.2 v13.8,24.6
DOOR_ON  (via drill 0.3 pad 0.7)
  Top 0.2: IC2.87 41.3,37.3 43.2,35.4 43.2,32.4 42.9,32.1 41.5,32.1 41.1,32.5 39.7,32.5 v38.7,31.5 | R9.7 24.5,24.5 | 24.5,24.5 Q3.5 | 24.5,24.5 25.1,24.5 25.2,24.4 29,24.4 30.5,25.9 v30.5,26.5
  Bottom 0.2: v30.5,26.5 30.8,26.5 32.9,28.6 33.7,28.6 34.9,29.8 37,29.8 v38.7,31.5
DOOR_R  (via drill 0.3 pad 0.7)
  Top 0.2: IC2.83 39.7,37.3 39.5,37.1 38.9,37.1 37.6,35.8 37.6,31.7 v37.8,31.5 | R50.1 28.3,25.9 28.1,26.1 28.1,28.1 28.3,28.3 R50.4 29.7,28.3 30.1,28.7 v30.7,28.7
  Bottom 0.2: v30.7,28.7 31.6,28.7 33.1,30.2 36.5,30.2 v37.8,31.5
DOOR_R_SW  (via drill 0.3 pad 0.7)
  Top 0.2: J15.4 4.16,29.54 7,26.7 v7.2,26.7 | R50.8 26.5,25.9 26.1,26.3 26.1,26.6 25.3,27.4 23.4,27.4 22.6,26.6 19.8,26.6 19,25.8 18.8,25.8 16.7,23.7 R49.2 16.41,23.8 14.3,23.8 14.2,23.9 13.6,23.9 13.21,24.29 C53.1 12.8,24.5 12.3,25 10.5,25 10.3,24.8 10.3,24.6 10,24.3 v9.9,24.3
  Bottom 0.2: v7.2,26.7 9.6,24.3 v9.9,24.3
DOUT_SM
  Top 0.2: IC17.28 64.6,53 63.9,53 63.85,52.95 62.65,52.95 59.65,49.95 59.65,49.35 52.7,42.4 IC2.7
ENSOLPWR(MH_PWR)  (via drill 0.3 pad 0.7)
  Top 0.2: R85.1 54.81,57.1 v53.7,57.1 53.5,57.1 52.9,56.5 52.9,53.5 51.6,52.2 48.9,52.2 46.6,49.9 46.6,48.6 46.2,48.2 46.2,47.6 44.7,46.1 44.7,45.7 v44.5,45.5 | IC2.97 45.3,40.4 42.9,42.8 42.5,42.8 41.5,43.8 v41.5,44.5 | R95.2 51.4,74.2 57.6,74.2 58.3,73.5 58.3,70.9 59,70.2 59,67.7 v59.1,67.6 60,67.6 60.31,67.92 Q23.5
  Bottom 0.2: v53.7,57.1 54.3,57.7 54.3,58.8 55.1,59.6 55.9,59.6 56.2,59.9 56.2,60.6 55.3,61.5 55.3,65.3 57.6,67.6 v59.1,67.6 | v41.5,44.5 41.8,44.5 42.8,45.5 v44.5,45.5
ENVBATCHRG(XB_RESET)  (via drill 0.3 pad 0.7)